# Altium project PAY_IF.PrjPcb (part 5 of 7)

## Sheet SAMA7D65_PIO.SchDoc
size A3; SheetNumber: 8; SheetTotal: 23
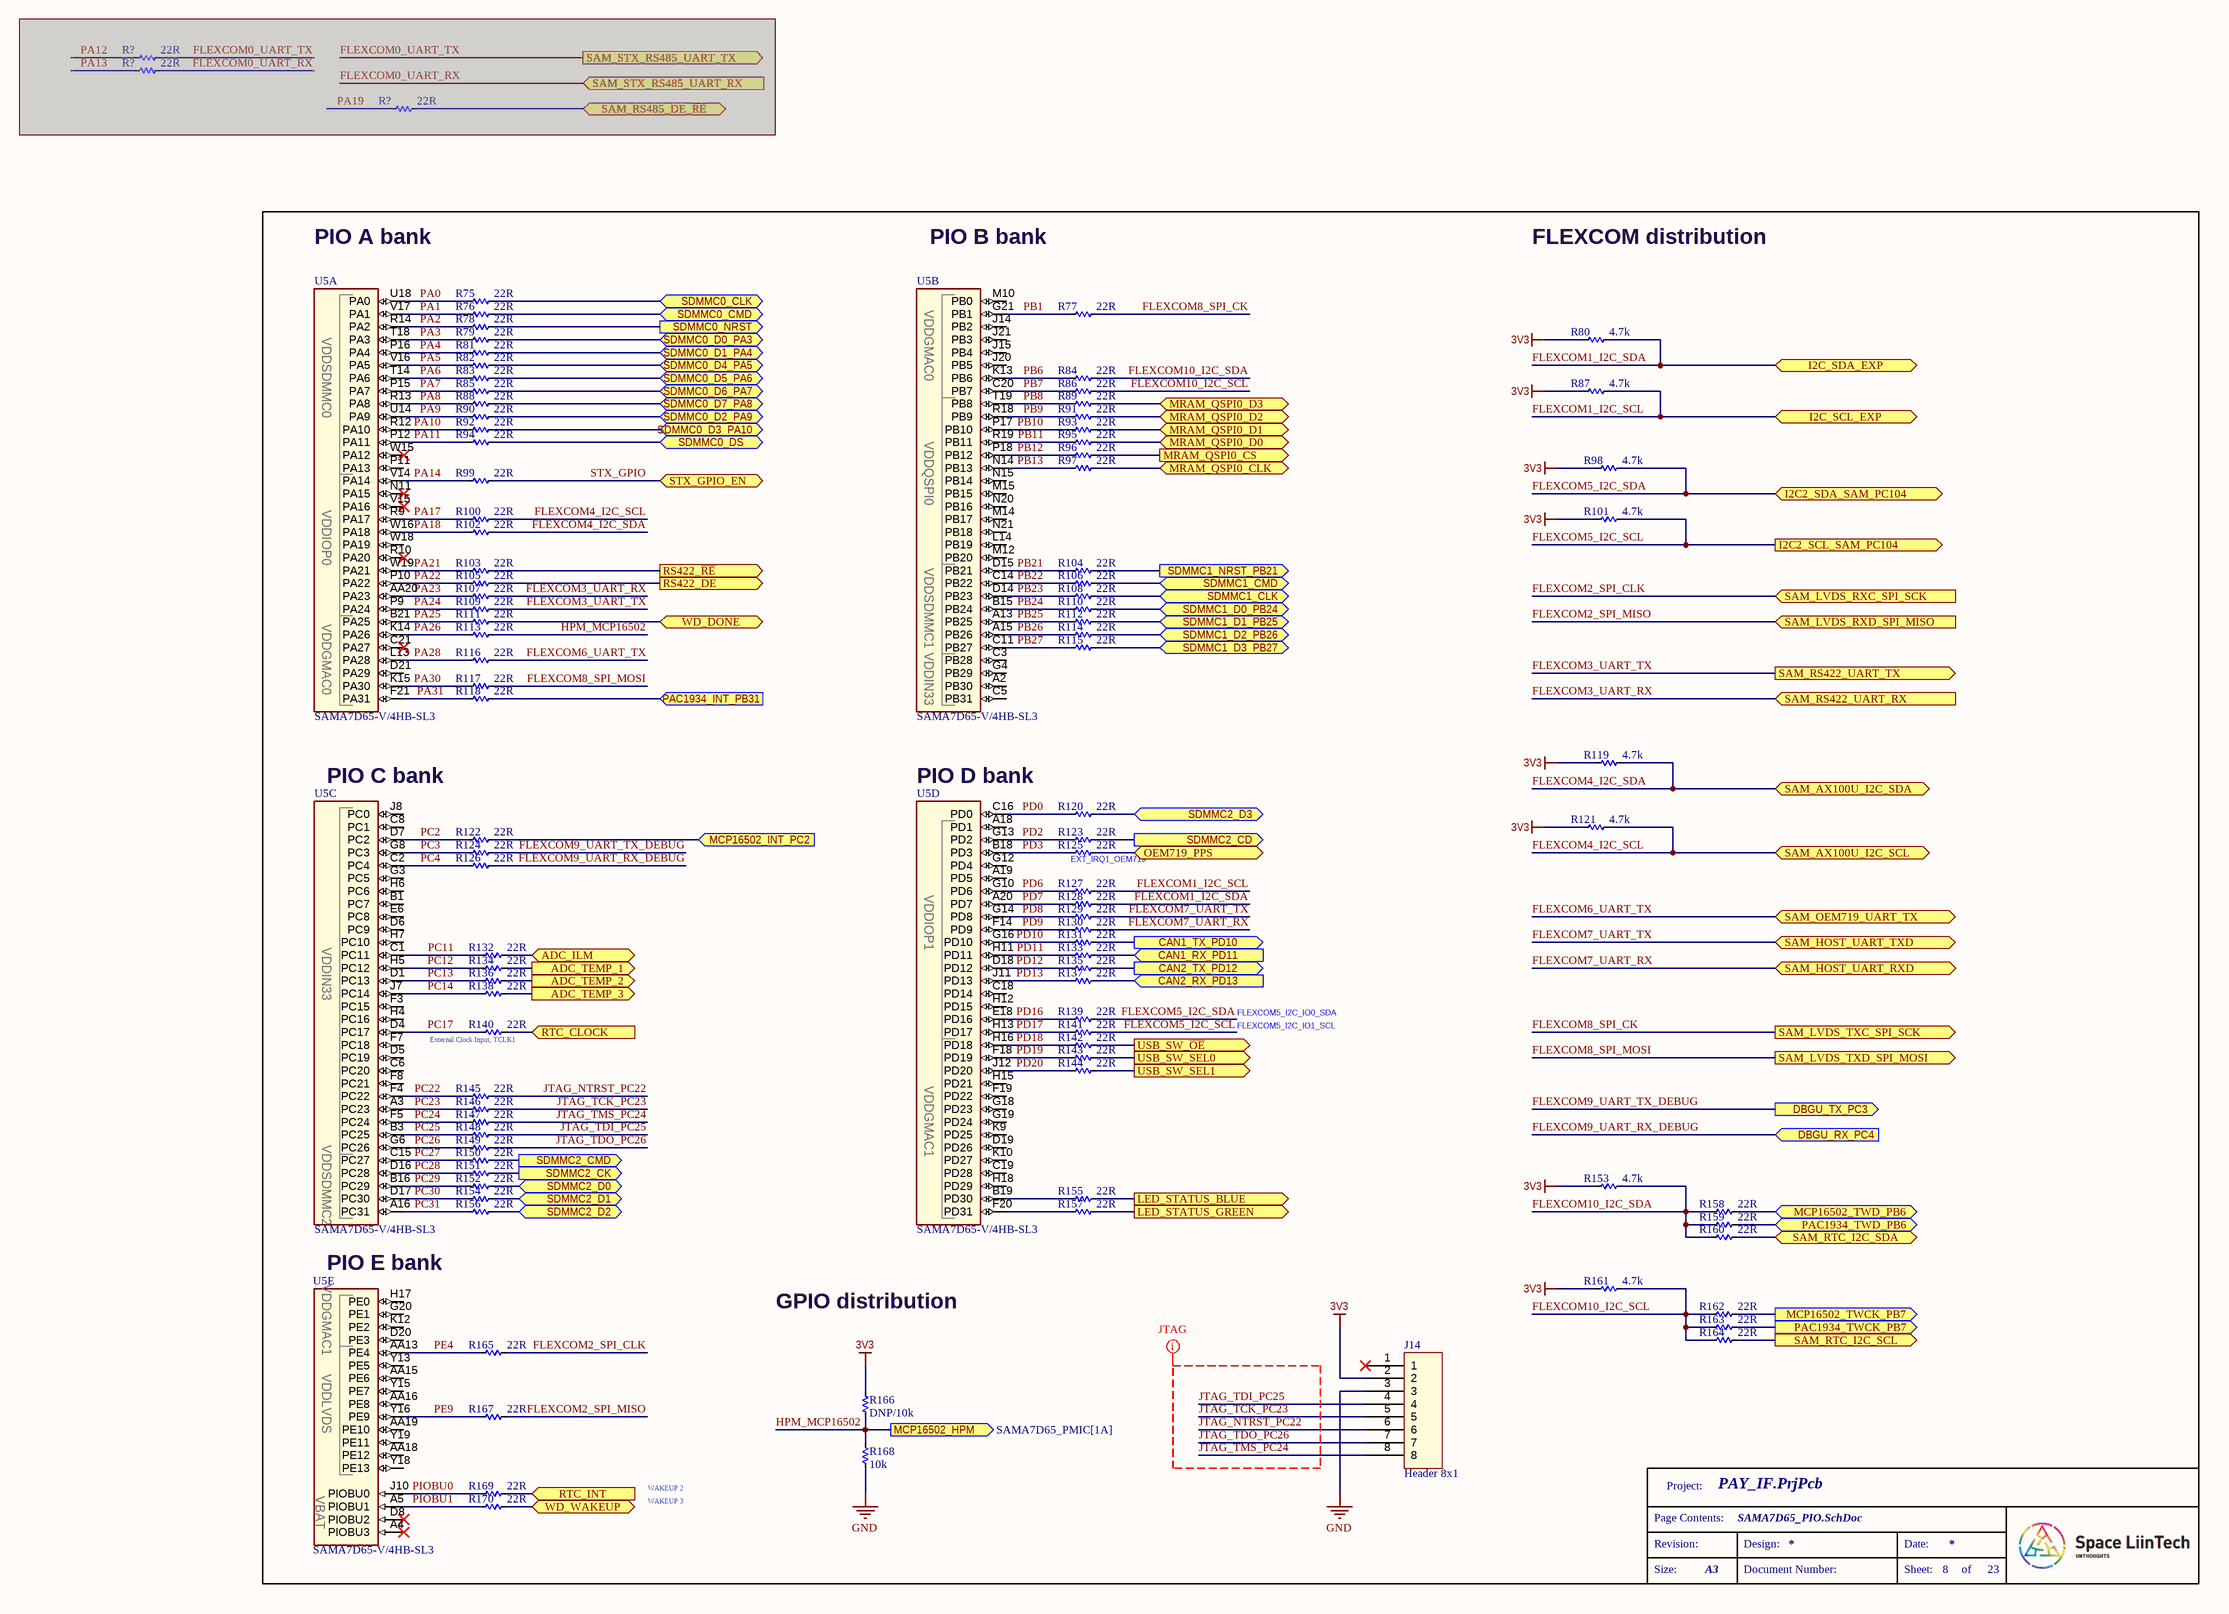
[diagram p8: SAMA7D65_PIO.SchDoc]

### Parts
(Parts that share a designator on the sheet are numbered #1, #2 ... from top to bottom, then left to right.)
J14#1  Header 8x1  [Header_254P_8x1]
R75  22R  [RES_C_0603X30]
R76  22R  [RES_C_0603X30]
R77  22R  [RES_C_0603X30]
R78  22R  [RES_C_0603X30]
R79  22R  [RES_C_0603X30]
R80  4.7k  [RES_C_1005x30_L]
R81  22R  [RES_C_0603X30]
R82  22R  [RES_C_0603X30]
R83  22R  [RES_C_0603X30]
R84  22R  [RES_C_0603X30]
R85  22R  [RES_C_0603X30]
R86  22R  [RES_C_0603X30]
R87  4.7k  [RES_C_1005x30_L]
R88  22R  [RES_C_0603X30]
R89  22R  [RES_C_0603X30]
R90  22R  [RES_C_0603X30]
R91  22R  [RES_C_0603X30]
R92  22R  [RES_C_0603X30]
R93  22R  [RES_C_0603X30]
R94  22R  [RES_C_0603X30]
R95  22R  [RES_C_0603X30]
R96  22R  [RES_C_0603X30]
R97  22R  [RES_C_0603X30]
R98  4.7k  [RES_C_1005x30_L]
R99  22R  [RES_C_0603X30]
R100  22R  [RES_C_0603X30]
R101  4.7k  [RES_C_1005x30_L]
R102  22R  [RES_C_0603X30]
R103  22R  [RES_C_0603X30]
R104  22R  [RES_C_0603X30]
R105  22R  [RES_C_0603X30]
R106  22R  [RES_C_0603X30]
R107  22R  [RES_C_0603X30]
R108  22R  [RES_C_0603X30]
R109  22R  [RES_C_0603X30]
R110  22R  [RES_C_0603X30]
R111  22R  [RES_C_0603X30]
R112  22R  [RES_C_0603X30]
R113  22R  [RES_C_0603X30]
R114  22R  [RES_C_0603X30]
R115  22R  [RES_C_0603X30]
R116  22R  [RES_C_0603X30]
R117  22R  [RES_C_0603X30]
R118  22R  [RES_C_0603X30]
R119  4.7k  [RES_C_1005x30_L]
R120  22R  [RES_C_0603X30]
R121  4.7k  [RES_C_1005x30_L]
R122  22R  [RES_C_0603X30]
R123  22R  [RES_C_0603X30]
R124  22R  [RES_C_0603X30]
R125  22R  [RES_C_0603X30]
R126  22R  [RES_C_0603X30]
R127  22R  [RES_C_0603X30]
R128  22R  [RES_C_0603X30]
R129  22R  [RES_C_0603X30]
R130  22R  [RES_C_0603X30]
R131  22R  [RES_C_0603X30]
R132  22R  [RES_C_0603X30]
R133  22R  [RES_C_0603X30]
R134  22R  [RES_C_0603X30]
R135  22R  [RES_C_0603X30]
R136  22R  [RES_C_0603X30]
R137  22R  [RES_C_0603X30]
R138  22R  [RES_C_0603X30]
R139  22R  [RES_C_0603X30]
R140  22R  [RES_C_0603X30]
R141  22R  [RES_C_0603X30]
R142  22R  [RES_C_0603X30]
R143  22R  [RES_C_0603X30]
R144  22R  [RES_C_0603X30]
R145  22R  [RES_C_0603X30]
R146  22R  [RES_C_0603X30]
R147  22R  [RES_C_0603X30]
R148  22R  [RES_C_0603X30]
R149  22R  [RES_C_0603X30]
R150  22R  [RES_C_0603X30]
R151  22R  [RES_C_0603X30]
R152  22R  [RES_C_0603X30]
R153  4.7k  [RES_C_1005x30_L]
R154  22R  [RES_C_0603X30]
R155  22R  [RES_C_0603X30]
R156  22R  [RES_C_0603X30]
R157  22R  [RES_C_0603X30]
R158  22R  [RES_C_0603X30]
R159  22R  [RES_C_0603X30]
R160  22R  [RES_C_0603X30]
R161  4.7k  [RES_C_1005x30_L]
R162  22R  [RES_C_0603X30]
R163  22R  [RES_C_0603X30]
R164  22R  [RES_C_0603X30]
R165  22R  [RES_C_0603X30]
R166#1  DNP/10k  [RES_C_1005x30_L]
R167#1  22R  [RES_C_0603X30]
R168  10k  [RES_C_1005x30_L]
R169  22R  [RES_C_0603X30]
R170  22R  [RES_C_0603X30]
R?#1  22R  [RES_C_0603X30]  (masked out: inside a compile mask, not in the netlist)
R?#2  22R  [RES_C_0603X30]  (masked out: inside a compile mask, not in the netlist)
R?#3  22R  [RES_C_0603X30]  (masked out: inside a compile mask, not in the netlist)
U5  value SAMA7D65-V/4HB-SL3  [TFBGA-343_14x14]  (hidden comment: SAMA7D65)  (parts A,B,C,D,E of 8)

### Ports
ADC_ILM (bidir, see POWER[6B]), ADC_TEMP_1 (out, see TEMP[5B]), ADC_TEMP_2 (out, see TEMP[5B]), ADC_TEMP_3 (out, see TEMP[5C]), CAN1_RX_PD11 (in, see CAN_PHY[3B]), CAN1_TX_PD10 (out, see CAN_PHY[3B]), CAN2_RX_PD13 (in, see CAN_PHY[3C]), CAN2_TX_PD12 (out, see CAN_PHY[3C]), DBGU_RX_PC4 (in, see DEBUG_CONSOLE[3C]), DBGU_TX_PC3 (out, see DEBUG_CONSOLE[3C]), I2C2_SCL_SAM_PC104 (out, see CONNECTOR_INTERFACE[4B]), I2C2_SDA_SAM_PC104 (bidir, see CONNECTOR_INTERFACE[4B]), I2C_SCL_EXP (bidir, see CONNECTOR_EXP[4C], CONNECTOR_INTERFACE[1D], CONNECTOR_INTERFACE[6B]), I2C_SDA_EXP (bidir, see CONNECTOR_EXP[4C], CONNECTOR_INTERFACE[1C], CONNECTOR_INTERFACE[6B]), LED_STATUS_BLUE (out, see BUTTON_LED[2B]), LED_STATUS_GREEN (out, see BUTTON_LED[2B]), MCP16502_HPM (out, see SAMA7D65_PMIC[1A]), MCP16502_INT_PC2 (in, see SAMA7D65_PMIC[1B]), MCP16502_TWCK_PB7 (out, see SAMA7D65_PMIC[1B]), MCP16502_TWD_PB6 (bidir, see SAMA7D65_PMIC[1B]), MRAM_QSPI0_CLK (bidir, see EEPROM[6C]), MRAM_QSPI0_CS (out, see EEPROM[3B]), MRAM_QSPI0_D0 (bidir, see EEPROM[6C]), MRAM_QSPI0_D1 (bidir, see EEPROM[3B]), MRAM_QSPI0_D2 (bidir, see EEPROM[3C]), MRAM_QSPI0_D3 (bidir, see EEPROM[6B]), OEM719_PPS (bidir, see CONNECTOR_INTERFACE[6B], CONNECTOR_INTERFACE[6D]), PAC1934_INT_PB31 (in, see SAMA7D65_PMIC[7B]), PAC1934_TWCK_PB7 (out, see SAMA7D65_PMIC[7B]), PAC1934_TWD_PB6 (bidir, see SAMA7D65_PMIC[7B]), RS422_DE (out, see RS422[1C]), RS422_~{RE} (out, see RS422[1B]), RTC_CLOCK (in, see RTC[6B]), RTC_INT (in, see RTC[6C]), SAM_AX100U_I2C_SCL (bidir, see CONNECTOR_INTERFACE[5C]), SAM_AX100U_I2C_SDA (bidir, see CONNECTOR_INTERFACE[7C]), SAM_HOST_UART_RXD (bidir, see CONNECTOR_INTERFACE[6D]), SAM_HOST_UART_TXD (bidir, see CONNECTOR_INTERFACE[7D]), SAM_LVDS_RXC_SPI_SCK (in, see LVDS[2C]), SAM_LVDS_RXD_SPI_MISO (in, see LVDS[2C]), SAM_LVDS_TXC_SPI_SCK (out, see LVDS[2B]), SAM_LVDS_TXD_SPI_MOSI (out, see LVDS[2A]), SAM_OEM719_UART_TX (bidir, see CONNECTOR_INTERFACE[4B], CONNECTOR_INTERFACE[7D]), SAM_RS422_UART_RX (in, see RS422[3B]), SAM_RS422_UART_TX (out, see RS422[3C]), SAM_RS485_DE_~{RE} (bidir), SAM_RTC_I2C_SCL (out, see RTC[3C]), SAM_RTC_I2C_SDA (bidir, see RTC[3C]), SAM_STX_RS485_UART_RX (in), SAM_STX_RS485_UART_TX (out), SDMMC0_CLK (bidir, see eMMC[2B]), SDMMC0_CMD (bidir, see eMMC[2B]), SDMMC0_D0_PA3 (bidir, see eMMC[2B]), SDMMC0_D1_PA4 (bidir, see eMMC[2B]), SDMMC0_D2_PA9 (bidir, see eMMC[2B]), SDMMC0_D3_PA10 (bidir, see eMMC[2B]), SDMMC0_D4_PA5 (bidir, see eMMC[2B]), SDMMC0_D5_PA6 (bidir, see eMMC[2B]), SDMMC0_D6_PA7 (bidir, see eMMC[2B]), SDMMC0_D7_PA8 (bidir, see eMMC[2B]), SDMMC0_DS (bidir, see eMMC[3B]), SDMMC0_NRST (out, see eMMC[3B]), SDMMC1_CLK (bidir, see eMMC[2C]), SDMMC1_CMD (bidir, see eMMC[2C]), SDMMC1_D0_PB24 (bidir, see eMMC[2C]), SDMMC1_D1_PB25 (bidir, see eMMC[2C]), SDMMC1_D2_PB26 (bidir, see eMMC[2D]), SDMMC1_D3_PB27 (bidir, see eMMC[2D]), SDMMC1_NRST_PB21 (out, see eMMC[3D]), SDMMC2_CD (out, see SDCARD[3B]), SDMMC2_CK (out, see SDCARD[3B]), SDMMC2_CMD (out, see SDCARD[3C]), SDMMC2_D0 (bidir, see SDCARD[3B]), SDMMC2_D1 (bidir, see SDCARD[3B]), SDMMC2_D2 (bidir, see SDCARD[3B]), SDMMC2_D3 (bidir, see SDCARD[3B]), STX_GPIO_EN (bidir, see CONNECTOR_INTERFACE[6A]), USB_SW_SEL0 (out, see USB_SWITCH[3C]), USB_SW_SEL1 (out, see USB_SWITCH[3C]), USB_SW_~{OE} (out, see USB_SWITCH[3B]), WD_DONE (bidir, see WATCHDOG[5B]), WD_WAKEUP (bidir, see WATCHDOG[5B])

### Nets
3V3: J14#1.2 R80.1 R87.1 R98.1 R101.1 R119.1 R121.1 R153.1 R161.1 R166#1.1
GND: J14#1.3 R168.2
ADC_TEMP_1: R134.2 ; port ADC_TEMP_1
ADC_TEMP_2: R136.2 ; port ADC_TEMP_2
ADC_TEMP_3: R138.2 ; port ADC_TEMP_3
FLEXCOM1_I2C_SCL: R87.2 R127.2 ; port I2C_SCL_EXP
FLEXCOM1_I2C_SDA: R80.2 R128.2 ; port I2C_SDA_EXP
FLEXCOM2_SPI_CLK: R165.2 ; port SAM_LVDS_RXC_SPI_SCK
FLEXCOM2_SPI_MISO: R167#1.2 ; port SAM_LVDS_RXD_SPI_MISO
FLEXCOM3_UART_RX: R107.2 ; port SAM_RS422_UART_RX
FLEXCOM3_UART_TX: R109.2 ; port SAM_RS422_UART_TX
FLEXCOM4_I2C_SCL: R100.2 R121.2 ; port SAM_AX100U_I2C_SCL
FLEXCOM4_I2C_SDA: R102.2 R119.2 ; port SAM_AX100U_I2C_SDA
FLEXCOM5_I2C_SCL: R101.2 R141.2 ; port I2C2_SCL_SAM_PC104
FLEXCOM5_I2C_SDA: R98.2 R139.2 ; port I2C2_SDA_SAM_PC104
FLEXCOM6_UART_TX: R116.2 ; port SAM_OEM719_UART_TX
FLEXCOM7_UART_RX: R130.2 ; port SAM_HOST_UART_RXD
FLEXCOM7_UART_TX: R129.2 ; port SAM_HOST_UART_TXD
FLEXCOM8_SPI_CK: R77.2 ; port SAM_LVDS_TXC_SPI_SCK
FLEXCOM8_SPI_MOSI: R117.2 ; port SAM_LVDS_TXD_SPI_MOSI
FLEXCOM9_UART_RX_DEBUG: R126.2 ; port DBGU_RX_PC4
FLEXCOM9_UART_TX_DEBUG: R124.2 ; port DBGU_TX_PC3
FLEXCOM10_I2C_SCL: R86.2 R161.2 R162.1 R163.1 R164.1
FLEXCOM10_I2C_SDA: R84.2 R153.2 R158.1 R159.1 R160.1
HPM_MCP16502: R113.2 R166#1.2 R168.1 ; port MCP16502_HPM
JTAG_NTRST_PC22: J14#1.6 R145.2
JTAG_TCK_PC23: J14#1.5 R146.2
JTAG_TDI_PC25: J14#1.4 R148.2
JTAG_TDO_PC26: J14#1.7 R149.2
JTAG_TMS_PC24: J14#1.8 R147.2
MRAM_QSPI_CLK: R97.2 ; port MRAM_QSPI0_CLK
MRAM_QSPI_CS: R96.2 ; port MRAM_QSPI0_CS
MRAM_QSPI_D0: R95.2 ; port MRAM_QSPI0_D0
MRAM_QSPI_D1: R93.2 ; port MRAM_QSPI0_D1
MRAM_QSPI_D2: R91.2 ; port MRAM_QSPI0_D2
MRAM_QSPI_D3: R89.2 ; port MRAM_QSPI0_D3
PA0: R75.1 U5.U18(PA0)
PA1: R76.1 U5.V17(PA1)
PA2: R78.1 U5.R14(PA2)
PA3: R79.1 U5.T18(PA3)
PA4: R81.1 U5.P16(PA4)
PA5: R82.1 U5.V16(PA5)
PA6: R83.1 U5.T14(PA6)
PA7: R85.1 U5.P15(PA7)
PA8: R88.1 U5.R13(PA8)
PA9: R90.1 U5.U14(PA9)
PA10: R92.1 U5.R12(PA10)
PA11: R94.1 U5.P12(PA11)
PA14: R99.1 U5.V14(PA14)
PA17: R100.1 U5.R9(PA17)
PA18: R102.1 U5.W16(PA18)
PA21: R103.1 U5.W19(PA21)
PA22: R105.1 U5.P10(PA22)
PA23: R107.1 U5.AA20(PA23)
PA24: R109.1 U5.P9(PA24)
PA25: R111.1 U5.B21(PA25)
PA26: R113.1 U5.K14(PA26)
PA28: R116.1 U5.L13(PA28)
PA30: R117.1 U5.K15(PA30)
PA31: R118.1 U5.F21(PA31)
PAC1934_TWCK: R163.2 ; port PAC1934_TWCK_PB7
PAC1934_TWD: R159.2 ; port PAC1934_TWD_PB6
PB1: R77.1 U5.G21(PB1)
PB6: R84.1 U5.K13(PB6)
PB7: R86.1 U5.C20(PB7)
PB8: R89.1 U5.T19(PB8)
PB9: R91.1 U5.R18(PB9)
PB10: R93.1 U5.P17(PB10)
PB11: R95.1 U5.R19(PB11)
PB12: R96.1 U5.P18(PB12)
PB13: R97.1 U5.N14(PB13)
PB21: R104.1 U5.D15(PB21)
PB22: R106.1 U5.C14(PB22)
PB23: R108.1 U5.D14(PB23)
PB24: R110.1 U5.B15(PB24)
PB25: R112.1 U5.A13(PB25)
PB26: R114.1 U5.A15(PB26)
PB27: R115.1 U5.C11(PB27)
PC2: R122.1 U5.D7(PC2)
PC3: R124.1 U5.G8(PC3)
PC4: R126.1 U5.C2(PC4)
PC11: R132.1 U5.C1(PC11)
PC12: R134.1 U5.H5(PC12)
PC13: R136.1 U5.D1(PC13)
PC14: R138.1 U5.J7(PC14)
PC17: R140.1 U5.D4(PC17)
PC22: R145.1 U5.F4(PC22)
PC23: R146.1 U5.A3(PC23)
PC24: R147.1 U5.F5(PC24)
PC25: R148.1 U5.B3(PC25)
PC26: R149.1 U5.G6(PC26)
PC27: R150.1 U5.C15(PC27)
PC28: R151.1 U5.D16(PC28)
PC29: R152.1 U5.B16(PC29)
PC30: R154.1 U5.D17(PC30)
PC31: R156.1 U5.A16(PC31)
PD0: R120.1 U5.C16(PD0)
PD2: R123.1 U5.G13(PD2)
PD3: R125.1 U5.B18(PD3)
PD6: R127.1 U5.G10(PD6)
PD7: R128.1 U5.A20(PD7)
PD8: R129.1 U5.G14(PD8)
PD9: R130.1 U5.F14(PD9)
PD10: R131.1 U5.G16(PD10)
PD11: R133.1 U5.H11(PD11)
PD12: R135.1 U5.D18(PD12)
PD13: R137.1 U5.J11(PD13)
PD16: R139.1 U5.E18(PD16)
PD17: R141.1 U5.H13(PD17)
PD18: R142.1 U5.H16(PD18)
PD19: R143.1 U5.F18(PD19)
PD20: R144.1 U5.J12(PD20)
PE4: R165.1 U5.AA13(PE4)
PE9: R167#1.1 U5.Y16(PE9)
PIOBU0: R169.1 U5.J10(PIOBU0)
PIOBU1: R170.1 U5.A5(PIOBU1)
RS422_DE: R105.2 ; port RS422_DE
RS422_~{RE}: R103.2 ; port RS422_~{RE}
SAM_RTC_I2C_SCL: R164.2 ; port SAM_RTC_I2C_SCL
SAM_RTC_I2C_SDA: R160.2 ; port SAM_RTC_I2C_SDA
SDMMC0_CLK: R75.2 ; port SDMMC0_CLK
SDMMC0_CMD: R76.2 ; port SDMMC0_CMD
SDMMC0_D0: R79.2 ; port SDMMC0_D0_PA3
SDMMC0_D1: R81.2 ; port SDMMC0_D1_PA4
SDMMC0_D2: R90.2 ; port SDMMC0_D2_PA9
SDMMC0_D3: R92.2 ; port SDMMC0_D3_PA10
SDMMC0_D4: R82.2 ; port SDMMC0_D4_PA5
SDMMC0_D5: R83.2 ; port SDMMC0_D5_PA6
SDMMC0_D6: R85.2 ; port SDMMC0_D6_PA7
SDMMC0_D7: R88.2 ; port SDMMC0_D7_PA8
SDMMC0_DS: R94.2 ; port SDMMC0_DS
SDMMC0_NRST: R78.2 ; port SDMMC0_NRST
SDMMC1_CLK: R108.2 ; port SDMMC1_CLK
SDMMC1_CMD: R106.2 ; port SDMMC1_CMD
SDMMC1_D0: R110.2 ; port SDMMC1_D0_PB24
SDMMC1_D1: R112.2 ; port SDMMC1_D1_PB25
SDMMC1_D2: R114.2 ; port SDMMC1_D2_PB26
SDMMC1_D3: R115.2 ; port SDMMC1_D3_PB27
SDMMC1_NRST: R104.2 ; port SDMMC1_NRST_PB21
STX_GPIO: R99.2 ; port STX_GPIO_EN
NetCR1_3: R151.2 ; port SDMMC2_CK
NetCR1_4: R152.2 ; port SDMMC2_D0
NetCR1_6: R154.2 ; port SDMMC2_D1
NetCR2_1: R150.2 ; port SDMMC2_CMD
NetCR2_4: R156.2 ; port SDMMC2_D2
NetCR2_6: R120.2 ; port SDMMC2_D3
NetD12_2: R155.2 ; port LED_STATUS_BLUE
NetD13_2: R157.2 ; port LED_STATUS_GREEN
NetJ13_19: R125.2 ; port OEM719_PPS
NetJ15_P9: R123.2 ; port SDMMC2_CD
NetR9_1: R132.2 ; port ADC_ILM
NetR52_1: R122.2 ; port MCP16502_INT_PC2
NetR54_1: R118.2 ; port PAC1934_INT_PB31
NetR111_2: R111.2 ; port WD_DONE
NetR131_2: R131.2 ; port CAN1_TX_PD10
NetR133_2: R133.2 ; port CAN1_RX_PD11
NetR135_2: R135.2 ; port CAN2_TX_PD12
NetR137_2: R137.2 ; port CAN2_RX_PD13
NetR140_2: R140.2 ; port RTC_CLOCK
NetR142_2: R142.2 ; port USB_SW_~{OE}
NetR143_2: R143.2 ; port USB_SW_SEL0
NetR144_2: R144.2 ; port USB_SW_SEL1
NetR155_1: R155.1 U5.B19(PD30)
NetR157_1: R157.1 U5.F20(PD31)
NetR158_2: R158.2 ; port MCP16502_TWD_PB6
NetR162_2: R162.2 ; port MCP16502_TWCK_PB7
NetR169_2: R169.2 ; port RTC_INT
NetR170_2: R170.2 ; port WD_WAKEUP

Not connected (* = marked no-connect by the designer): J14#1 1*; U5 A2(PB30) A4(PIOBU3)* A18(PD1) A19(PD5) AA15(PE6) AA16(PE8) AA18(PE12) AA19(PE10) B1(PC7) C3(PB28) C5(PB31) C6(PC20) C8(PC1) C18(PD14) C19(PD28) C21(PA27)* D5(PC19) D6(PC9) D8(PIOBU2)* D19(PD26) D20(PE3) D21(PA29) E6(PC8) F3(PC15) F7(PC18) F8(PC21) F19(PD22) G3(PC5) G4(PB29) G12(PD4) G18(PD23) G19(PD24) G20(PE1) H4(PC16) H6(PC6) H7(PC10) H12(PD15) H15(PD21) H17(PE0) H18(PD29) J8(PC0) J14(PB2) J15(PB4) J20(PB5) J21(PB3) K9(PD25) K10(PD27) K12(PE2) L14(PB19) M10(PB0) M12(PB20) M14(PB17) M15(PB15) N11(PA15)* N15(PB14) N20(PB16) N21(PB18) P11(PA13) R10(PA20)* V15(PA16)* W15(PA12)* W18(PA19) Y13(PE5) Y15(PE7) Y18(PE13) Y19(PE11)

### Layout directives
net class JTAG; rule Matched Net Lengths [Tolerance = 2mm]: JTAG_NTRST_PC22, JTAG_TCK_PC23, JTAG_TDI_PC25, JTAG_TDO_PC26, JTAG_TMS_PC24

### Notes on the sheet
- PIO A bank
- PIO B bank
- FLEXCOM distribution
- (near U5) PIO C bank
- (near U5) PIO D bank
- (near R125) EXT_IRQ1_OEM719
- (near R140) External Clock Input, TCLK1
- FLEXCOM5_I2C_IO0_SDA
- FLEXCOM5_I2C_IO1_SCL
- (near U5) PIO E bank
- GPIO distribution
- WAKEUP 2
- WAKEUP 3
- Project:
- Page Contents:
- Revision:
- Design:
- Date:
- Size:
- A3
- Document Number:
- Sheet:
- of

### Library data of the parts
R75-R165 R166#1 R167#1 R168-R170 R?#1-R?#3 = _RES_B_2: RES
U5 = SAMA7D65: SAMA7D65 MPU 1000MHz Cortex-A7 TFBGA-343; Manufacturer 1: Microchip Technology; Description_: MCHP MPU 32-BIT Cortex-A7 1000MHz 128kB SAMA7D65-V/4HB-SL3 TFBGA-343; Populated: YES; MCHP-ID: IC2674; Symbol: SAMA7D65-TFBGA-343; Dev Tools Status: Design; Owner: Ciprian Abramov; Restricted Sourcing: No; Manufacturer Part Number 1: SAMA7D65-V/4HB-SL3; Type: 32-Bit MPU; Status: MCL Design; Revision: 1; Category: MCHP-Microcontroller; ComponentLink1URL: https://www.microchip.com/sitesearch/search/Product%20and%20Development%20Tools/SAMA7D65-V/4HB-SL3; ComponentLink1Description: SVN Datasheet; ComponentLink2Description: Local Datasheet; ComponentLink3URL: C:\ALTIUM_WORK\00001_MCHP-CDB\Library\LibraryRefs\SAMA7D65-TFBGA-343.SchLib; ComponentLink3Description: Open Symbol; ComponentLink4URL: C:\ALTIUM_WORK\00001_MCHP-CDB\Library\Footprints\TFBGA-343_14x14.PcbLib; ComponentLink4Description: Open Footprint; ComponentLink5Description: Open Footprint 2; ComponentLink6Description: Open Footprint 3; ComponentLink7Description: Open Footprint 4; Supplier 1: Microchip Technology; Supplier Part Number 1: SAMA7D65-V/4HB-SL3; Operating Temperature: -40C to +105C; Quantity Override: 1

## Sheet SAMA7D65_DDR3L.SchDoc
size A3; SheetNumber: 9; SheetTotal: 23
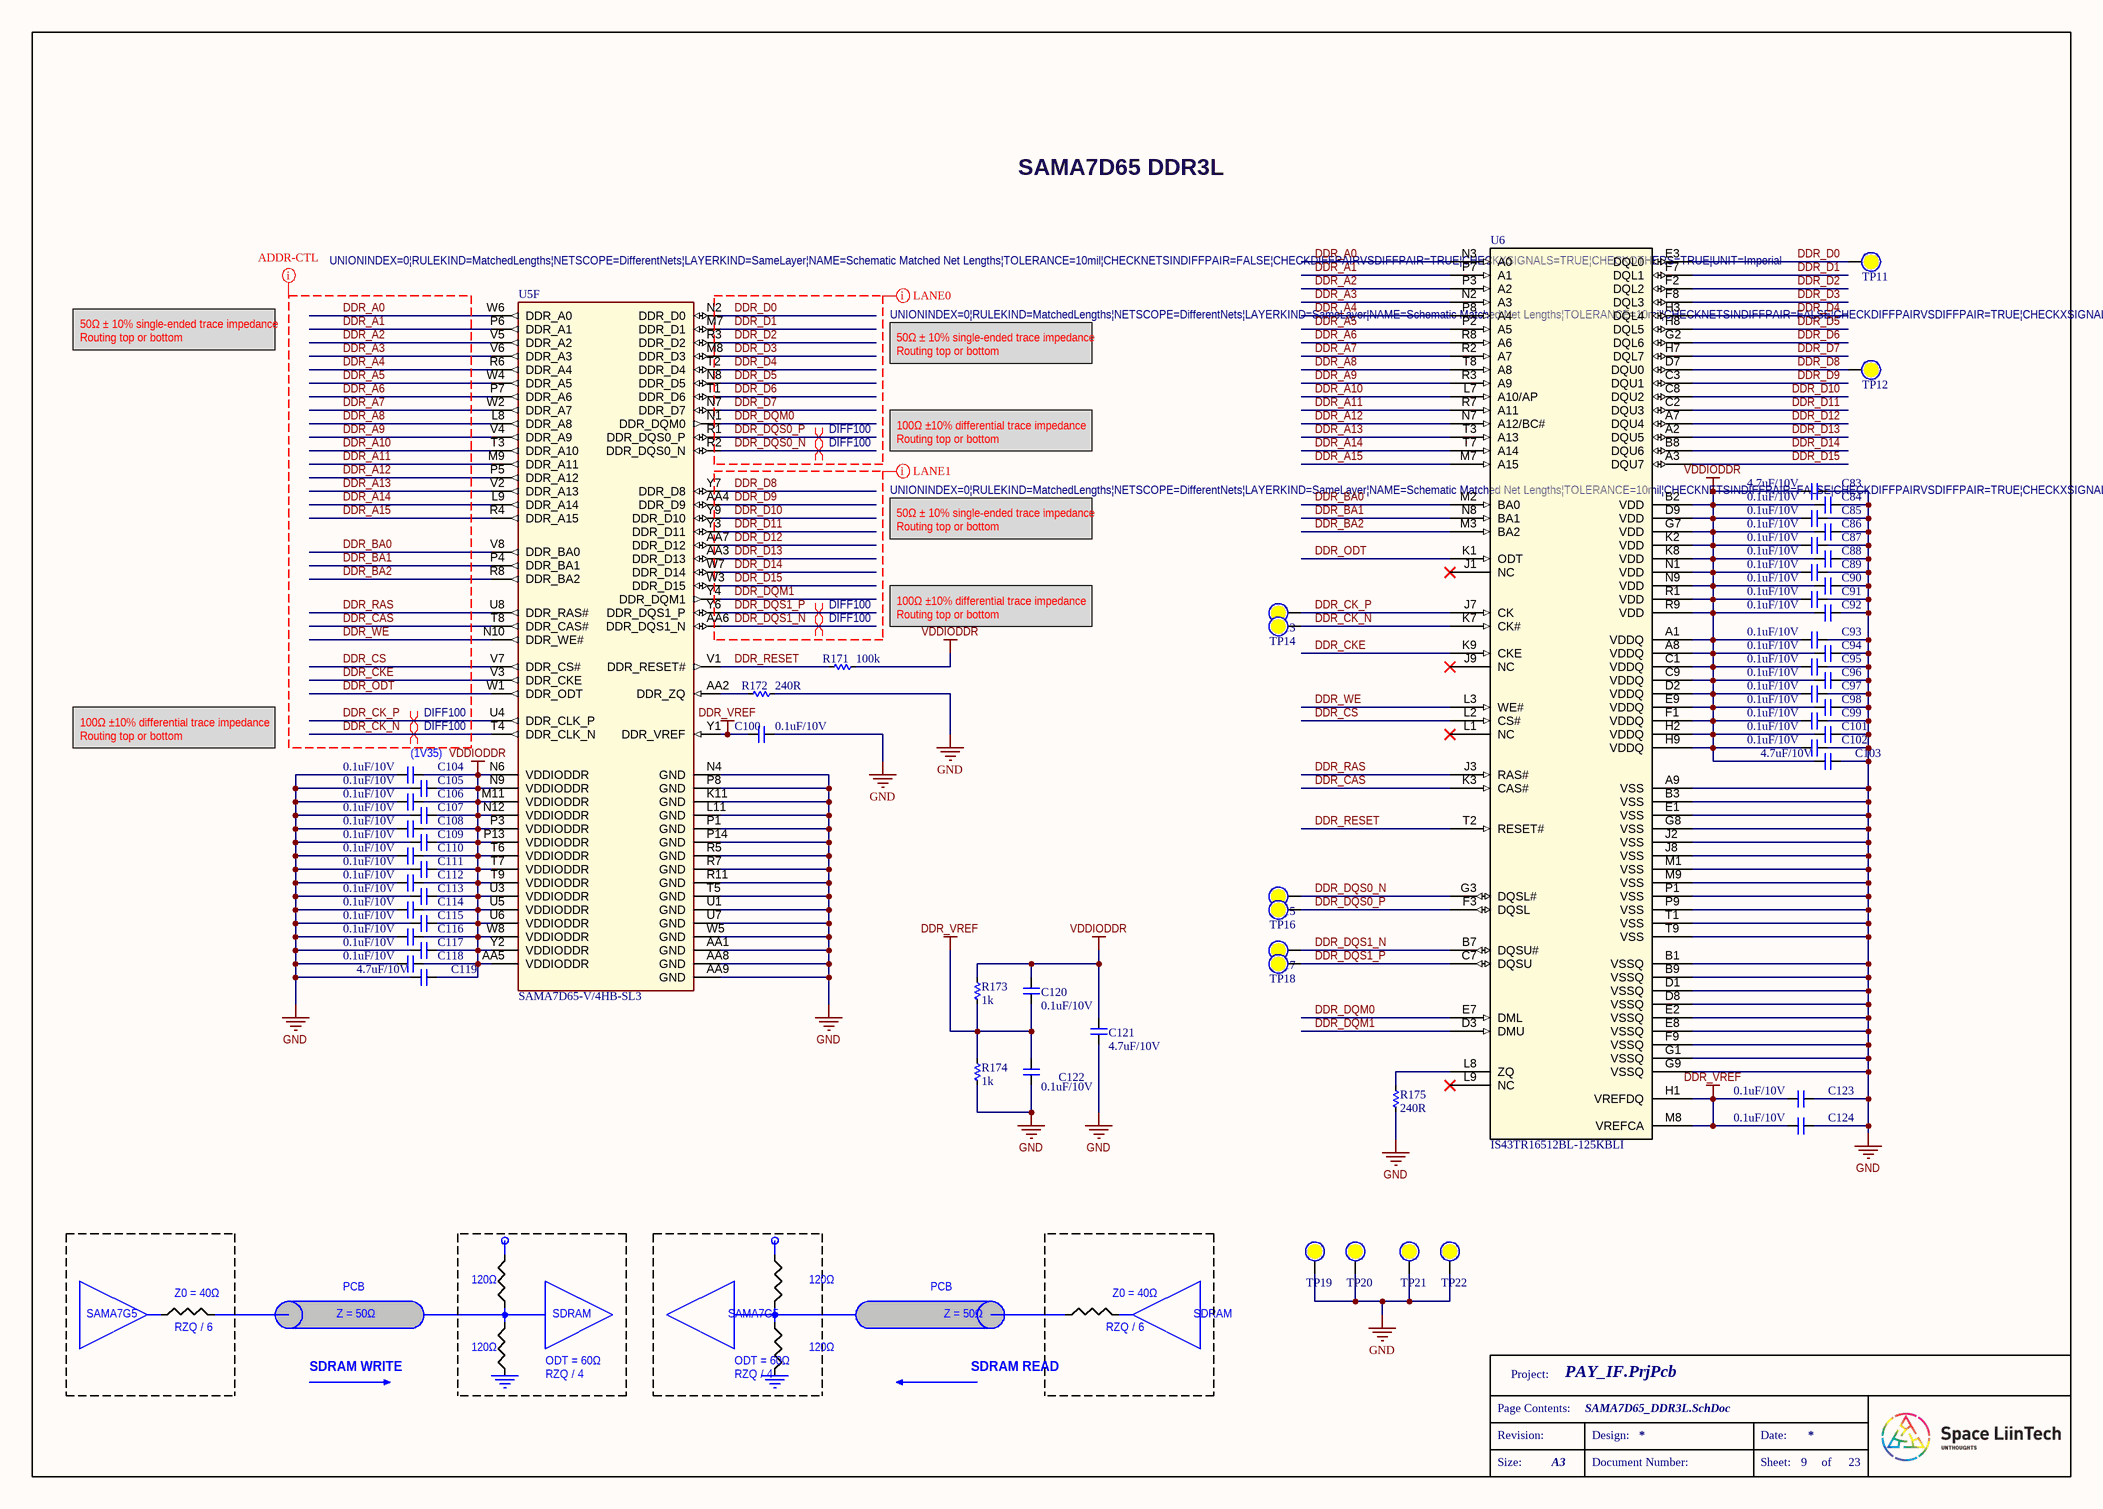
[diagram p9: SAMA7D65_DDR3L.SchDoc]

### Parts
C83  4.7uF/10V  [CAP_C_1005X50_L]
C84  0.1uF/10V  [CAP_C_0603x30]
C85  0.1uF/10V  [CAP_C_0603x30]
C86  0.1uF/10V  [CAP_C_0603x30]
C87  0.1uF/10V  [CAP_C_0603x30]
C88  0.1uF/10V  [CAP_C_0603x30]
C89  0.1uF/10V  [CAP_C_0603x30]
C90  0.1uF/10V  [CAP_C_0603x30]
C91  0.1uF/10V  [CAP_C_0603x30]
C92  0.1uF/10V  [CAP_C_0603x30]
C93  0.1uF/10V  [CAP_C_0603x30]
C94  0.1uF/10V  [CAP_C_0603x30]
C95  0.1uF/10V  [CAP_C_0603x30]
C96  0.1uF/10V  [CAP_C_0603x30]
C97  0.1uF/10V  [CAP_C_0603x30]
C98  0.1uF/10V  [CAP_C_0603x30]
C99  0.1uF/10V  [CAP_C_0603x30]
C100  0.1uF/10V  [CAP_C_0603x30]
C101  0.1uF/10V  [CAP_C_0603x30]
C102  0.1uF/10V  [CAP_C_0603x30]
C103  4.7uF/10V  [CAP_C_1005X50_L]
C104  0.1uF/10V  [CAP_C_0603x30]
C105  0.1uF/10V  [CAP_C_0603x30]
C106  0.1uF/10V  [CAP_C_0603x30]
C107  0.1uF/10V  [CAP_C_0603x30]
C108  0.1uF/10V  [CAP_C_0603x30]
C109  0.1uF/10V  [CAP_C_0603x30]
C110  0.1uF/10V  [CAP_C_0603x30]
C111  0.1uF/10V  [CAP_C_0603x30]
C112  0.1uF/10V  [CAP_C_0603x30]
C113  0.1uF/10V  [CAP_C_0603x30]
C114  0.1uF/10V  [CAP_C_0603x30]
C115  0.1uF/10V  [CAP_C_0603x30]
C116  0.1uF/10V  [CAP_C_0603x30]
C117  0.1uF/10V  [CAP_C_0603x30]
C118  0.1uF/10V  [CAP_C_0603x30]
C119  4.7uF/10V  [CAP_C_1005X50_L]
C120  0.1uF/10V  [CAP_C_0603x30]
C121  4.7uF/10V  [CAP_C_1005X50_L]
C122  0.1uF/10V  [CAP_C_0603x30]
C123  0.1uF/10V  [CAP_C_0603x30]
C124  0.1uF/10V  [CAP_C_0603x30]
R171  100k  [RES_C_1005x30_L]
R172  240R  [RES_C_0603X30]
R173  1k  [RES_C_1005x30_L]
R174  1k  [RES_C_1005x30_L]
R175  240R  [RES_C_0603X30]
TP11  (no value)  [Test point]  (no BOM)
TP12  (no value)  [Test point]  (no BOM)
TP13  (no value)  [Test point]  (no BOM)
TP14  (no value)  [Test point]  (no BOM)
TP15  (no value)  [Test point]  (no BOM)
TP16  (no value)  [Test point]  (no BOM)
TP17  (no value)  [Test point]  (no BOM)
TP18  (no value)  [Test point]  (no BOM)
TP19  (no value)  [Test point]  (no BOM)
TP20  (no value)  [Test point]  (no BOM)
TP21  (no value)  [Test point]  (no BOM)
TP22  (no value)  [Test point]  (no BOM)
U5  value SAMA7D65-V/4HB-SL3  [TFBGA-343_14x14]  (hidden comment: SAMA7D65)  (part F of 8)
U6  IS43TR16512BL-125KBLI  [TWBGA96_ISI]

### Nets
DDR_VREF: C100.1 C120.1 C122.2 C123.1 C124.1 R173.1 R174.2 U5.Y1(DDR_VREF) U6.H1(VREFDQ) U6.M8(VREFCA)
GND: C83.2 C84.2 C85.2 C86.2 C87.2 C88.2 C89.2 C90.2 C91.2 C92.2 C93.2 C94.2 C95.2 C96.2 C97.2 C98.2 C99.2 C100.2 C101.2 C102.2 C103.2 C104.1 C105.1 C106.1 C107.1 C108.1 C109.1 C110.1 C111.1 C112.1 C113.1 C114.1 C115.1 C116.1 C117.1 C118.1 C119.1 C121.1 C122.1 C123.2 C124.2 R172.2 R174.1 R175.1 TP19.0 TP20.0 TP21.0 TP22.0 U5.AA1(GND) U5.AA8(GND) U5.AA9(GND) U5.K11(GND) U5.L11(GND) U5.N4(GND) U5.P1(GND) U5.P8(GND) U5.P14(GND) U5.R5(GND) U5.R7(GND) U5.R11(GND) U5.T5(GND) U5.U1(GND) U5.U7(GND) U5.W5(GND) U6.A9(VSS) U6.B1(VSSQ) U6.B3(VSS) U6.B9(VSSQ) U6.D1(VSSQ) U6.D8(VSSQ) U6.E1(VSS) U6.E2(VSSQ) U6.E8(VSSQ) U6.F9(VSSQ) U6.G1(VSSQ) U6.G8(VSS) U6.G9(VSSQ) U6.J2(VSS) U6.J8(VSS) U6.M1(VSS) U6.M9(VSS) U6.P1(VSS) U6.P9(VSS) U6.T1(VSS) U6.T9(VSS)
VDDIODDR: C83.1 C84.1 C85.1 C86.1 C87.1 C88.1 C89.1 C90.1 C91.1 C92.1 C93.1 C94.1 C95.1 C96.1 C97.1 C98.1 C99.1 C101.1 C102.1 C103.1 C104.2 C105.2 C106.2 C107.2 C108.2 C109.2 C110.2 C111.2 C112.2 C113.2 C114.2 C115.2 C116.2 C117.2 C118.2 C119.2 C120.2 C121.2 R171.2 R173.2 U5.AA5(VDDIODDR) U5.M11(VDDIODDR) U5.N6(VDDIODDR) U5.N9(VDDIODDR) U5.N12(VDDIODDR) U5.P3(VDDIODDR) U5.P13(VDDIODDR) U5.T6(VDDIODDR) U5.T7(VDDIODDR) U5.T9(VDDIODDR) U5.U3(VDDIODDR) U5.U5(VDDIODDR) U5.U6(VDDIODDR) U5.W8(VDDIODDR) U5.Y2(VDDIODDR) U6.A1(VDDQ) U6.A8(VDDQ) U6.B2(VDD) U6.C1(VDDQ) U6.C9(VDDQ) U6.D2(VDDQ) U6.D9(VDD) U6.E9(VDDQ) U6.F1(VDDQ) U6.G7(VDD) U6.H2(VDDQ) U6.H9(VDDQ) U6.K2(VDD) U6.K8(VDD) U6.N1(VDD) U6.N9(VDD) U6.R1(VDD) U6.R9(VDD)
DDR_A0: U5.W6(DDR_A0) U6.N3(A0)
DDR_A1: U5.P6(DDR_A1) U6.P7(A1)
DDR_A2: U5.V5(DDR_A2) U6.P3(A2)
DDR_A3: U5.V6(DDR_A3) U6.N2(A3)
DDR_A4: U5.R6(DDR_A4) U6.P8(A4)
DDR_A5: U5.W4(DDR_A5) U6.P2(A5)
DDR_A6: U5.P7(DDR_A6) U6.R8(A6)
DDR_A7: U5.W2(DDR_A7) U6.R2(A7)
DDR_A8: U5.L8(DDR_A8) U6.T8(A8)
DDR_A9: U5.V4(DDR_A9) U6.R3(A9)
DDR_A10: U5.T3(DDR_A10) U6.L7(A10/AP)
DDR_A11: U5.M9(DDR_A11) U6.R7(A11)
DDR_A12: U5.P5(DDR_A12) U6.N7(A12/BC#)
DDR_A13: U5.V2(DDR_A13) U6.T3(A13)
DDR_A14: U5.L9(DDR_A14) U6.T7(A14)
DDR_A15: U5.R4(DDR_A15) U6.M7(A15)
DDR_BA0: U5.V8(DDR_BA0) U6.M2(BA0)
DDR_BA1: U5.P4(DDR_BA1) U6.N8(BA1)
DDR_BA2: U5.R8(DDR_BA2) U6.M3(BA2)
DDR_CAS: U5.T8(DDR_CAS#) U6.K3(CAS#)
DDR_CK_N: TP14.0 U5.T4(DDR_CLK_N) U6.K7(CK#)
DDR_CK_P: TP13.0 U5.U4(DDR_CLK_P) U6.J7(CK)
DDR_CKE: U5.V3(DDR_CKE) U6.K9(CKE)
DDR_CS: U5.V7(DDR_CS#) U6.L2(CS#)
DDR_D0: TP11.0 U5.N2(DDR_D0) U6.E3(DQL0)
DDR_D1: U5.M7(DDR_D1) U6.F7(DQL1)
DDR_D2: U5.R3(DDR_D2) U6.F2(DQL2)
DDR_D3: U5.M8(DDR_D3) U6.F8(DQL3)
DDR_D4: U5.T2(DDR_D4) U6.H3(DQL4)
DDR_D5: U5.N8(DDR_D5) U6.H8(DQL5)
DDR_D6: U5.T1(DDR_D6) U6.G2(DQL6)
DDR_D7: U5.N7(DDR_D7) U6.H7(DQL7)
DDR_D8: TP12.0 U5.Y7(DDR_D8) U6.D7(DQU0)
DDR_D9: U5.AA4(DDR_D9) U6.C3(DQU1)
DDR_D10: U5.Y9(DDR_D10) U6.C8(DQU2)
DDR_D11: U5.Y3(DDR_D11) U6.C2(DQU3)
DDR_D12: U5.AA7(DDR_D12) U6.A7(DQU4)
DDR_D13: U5.AA3(DDR_D13) U6.A2(DQU5)
DDR_D14: U5.W7(DDR_D14) U6.B8(DQU6)
DDR_D15: U5.W3(DDR_D15) U6.A3(DQU7)
DDR_DQM0: U5.N1(DDR_DQM0) U6.E7(DML)
DDR_DQM1: U5.Y4(DDR_DQM1) U6.D3(DMU)
DDR_DQS0_N: TP15.0 U5.R2(DDR_DQS0_N) U6.G3(DQSL#)
DDR_DQS0_P: TP16.0 U5.R1(DDR_DQS0_P) U6.F3(DQSL)
DDR_DQS1_N: TP17.0 U5.AA6(DDR_DQS1_N) U6.B7(DQSU#)
DDR_DQS1_P: TP18.0 U5.Y6(DDR_DQS1_P) U6.C7(DQSU)
DDR_ODT: U5.W1(DDR_ODT) U6.K1(ODT)
DDR_RAS: U5.U8(DDR_RAS#) U6.J3(RAS#)
DDR_RESET: R171.1 U5.V1(DDR_RESET#) U6.T2(RESET#)
DDR_WE: U5.N10(DDR_WE#) U6.L3(WE#)
NetR172_1: R172.1 U5.AA2(DDR_ZQ)
NetR175_2: R175.2 U6.L8(ZQ)

Not connected (* = marked no-connect by the designer): U6 J1(NC)* J9(NC)* L1(NC)* L9(NC)*

### Layout directives
net class DDR-ADDR-CTL; rule Matched Net Lengths [Tolerance = 10mil]: DDR_A0, DDR_A1, DDR_A2, DDR_A3, DDR_A4, DDR_A5, DDR_A6, DDR_A7, DDR_A8, DDR_A9, DDR_A10, DDR_A11, DDR_A12, DDR_A13, DDR_A14, DDR_A15, DDR_BA0, DDR_BA1, DDR_BA2, DDR_CAS, DDR_CK_N, DDR_CK_P, DDR_CKE, DDR_CS, DDR_ODT, DDR_RAS, DDR_WE
differential pair; differential pair class DIFF100; net class DIFF100; rule Matched Net Lengths [Tolerance = 4mil]: DDR_CK_N, DDR_CK_P, DDR_DQS0_N, DDR_DQS0_P, DDR_DQS1_N, DDR_DQS1_P
net class DDR-LANE0; rule Matched Net Lengths [Tolerance = 10mil]: DDR_D0, DDR_D1, DDR_D2, DDR_D3, DDR_D4, DDR_D5, DDR_D6, DDR_D7, DDR_DQM0, DDR_DQS0_N, DDR_DQS0_P
net class DDR-LANE1; rule Matched Net Lengths [Tolerance = 10mil]: DDR_D8, DDR_D9, DDR_D10, DDR_D11, DDR_D12, DDR_D13, DDR_D14, DDR_D15, DDR_DQM1, DDR_DQS1_N, DDR_DQS1_P

### Notes on the sheet
- SAMA7D65 DDR3L
- 50Ω ± 10% single-ended trace impedance
  Routing top or bottom
- 100Ω ±10% differential trace impedance
  Routing top or bottom
- (near C104) (1V35)
- SAMA7G5
- Z0 = 40Ω
- Z = 50Ω
- PCB
- 120Ω
- SDRAM
- RZQ / 6
- SDRAM WRITE
- ODT = 60Ω
- RZQ / 4
- SDRAM READ
- Project:
- Page Contents:
- Revision:
- Design:
- Date:
- Size:
- A3
- Document Number:
- Sheet:
- of

### Library data of the parts
C83-C124 = _CAP_C_2: CAP CHIP
R171-R175 = _RES_B_2: RES
TP11-TP22 = Test Point: Solder: NF
U5 = SAMA7D65: as U5 on sheet SAMA7D65_PIO; Manufacturer Part Number 1: SAMA7D65-V/4HB-SL3; Type: 32-Bit MPU; Status: MCL Design; Revision: 1; Category: MCHP-Microcontroller; ComponentLink1URL: https://www.microchip.com/sitesearch/search/Product%20and%20Development%20Tools/SAMA7D65-V/4HB-SL3; ComponentLink1Description: SVN Datasheet; ComponentLink2Description: Local Datasheet; ComponentLink3URL: C:\ALTIUM_WORK\00001_MCHP-CDB\Library\LibraryRefs\SAMA7D65-TFBGA-343.SchLib; ComponentLink3Description: Open Symbol; ComponentLink4URL: C:\ALTIUM_WORK\00001_MCHP-CDB\Library\Footprints\TFBGA-343_14x14.PcbLib; ComponentLink4Description: Open Footprint; ComponentLink5Description: Open Footprint 2; ComponentLink6Description: Open Footprint 3; ComponentLink7Description: Open Footprint 4; Supplier 1: Microchip Technology; Supplier Part Number 1: SAMA7D65-V/4HB-SL3; Operating Temperature: -40C to +105C; Quantity Override: 1
U6 = IC_RAM_IS43TR16512BL-125KBLI: DDR3L; Manufacturer_Name: ISSI; Copyright: Copyright (C) 2025 Ultra Librarian. All rights reserved.; Manufacturer_Part_Number: IS43TR16512BL-125KBLI; RefDes: RefDes; Type: Type

## Sheet SDCARD.SchDoc
size A3; SheetNumber: 10; SheetTotal: 23
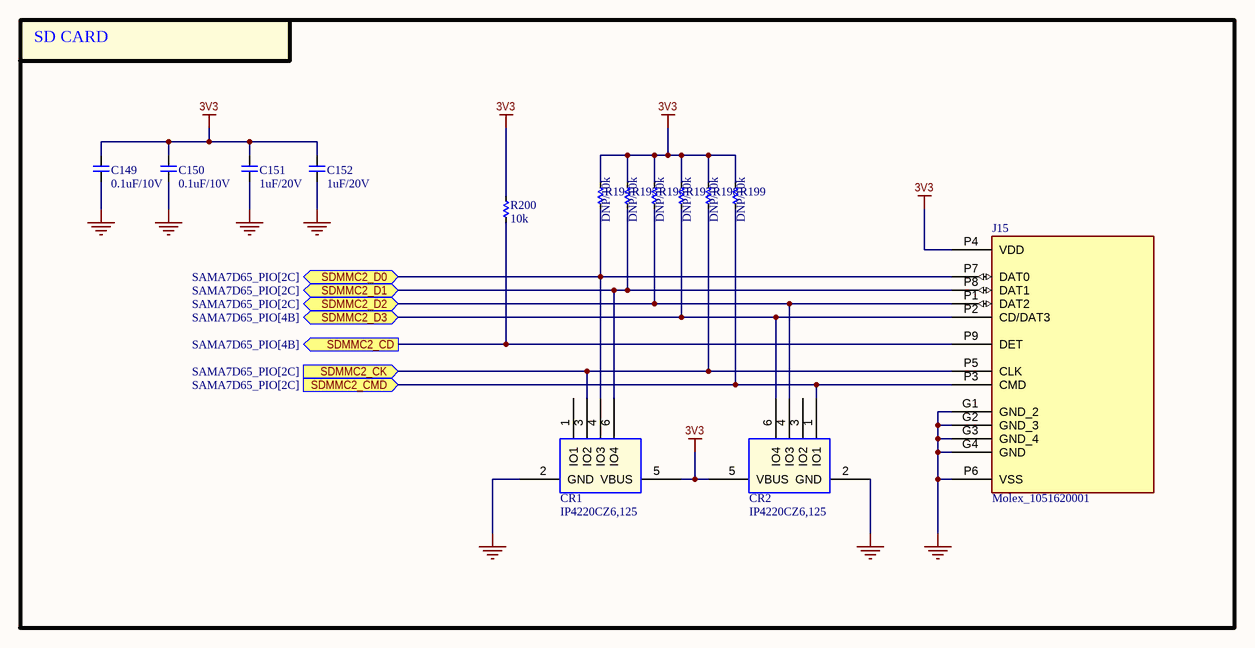
[diagram p10: SDCARD.SchDoc]

### Parts
(Parts that share a designator on the sheet are numbered #1, #2 ... from top to bottom, then left to right.)
C149  0.1uF/10V  [CAP_C_1005X50_L]
C150#1  0.1uF/10V  [CAP_C_1005X50_L]
C151  1uF/20V  [CAP_C_1005X50_L]
C152  1uF/20V  [CAP_C_1005X50_L]
CR1  IP4220CZ6,125  [DIODE_SOT457_1P7X3P1_NEX]
CR2  IP4220CZ6,125  [DIODE_SOT457_1P7X3P1_NEX]
J15  Molex_1051620001  [MOLEX_1051620001]
R194  DNP/10k  [RES_C_1005x30_L]
R195  DNP/10k  [RES_C_1005x30_L]
R196  DNP/10k  [RES_C_1005x30_L]
R197  DNP/10k  [RES_C_1005x30_L]
R198  DNP/10k  [RES_C_1005x30_L]
R199  DNP/10k  [RES_C_1005x30_L]
R200  10k  [RES_C_1005x30_L]

### Blocks framed on the sheet
SD CARD: C149 C150#1 C151 C152 CR1 CR2 J15 R194-R200

### Ports
SDMMC2_CD (out, see SAMA7D65_PIO[4B]), SDMMC2_CK (in, see SAMA7D65_PIO[2C]), SDMMC2_CMD (in, see SAMA7D65_PIO[2C]), SDMMC2_D0 (bidir, see SAMA7D65_PIO[2C]), SDMMC2_D1 (bidir, see SAMA7D65_PIO[2C]), SDMMC2_D2 (bidir, see SAMA7D65_PIO[2C]), SDMMC2_D3 (bidir, see SAMA7D65_PIO[4B])

### Nets
3V3: C149.2 C150#1.2 C151.2 C152.2 CR1.5(VBUS) CR2.5(VBUS) J15.P4(VDD) R194.2 R195.2 R196.2 R197.2 R198.2 R199.2 R200.2
GND: C149.1 C150#1.1 C151.1 C152.1 CR1.2(GND) CR2.2(GND) J15.G1(GND_2) J15.G2(GND_3) J15.G3(GND_4) J15.G4(GND) J15.P6(VSS)
NetCR1_3: CR1.3(IO2) J15.P5(CLK) R198.1 ; port SDMMC2_CK
NetCR1_4: CR1.4(IO3) J15.P7(DAT0) R194.1 ; port SDMMC2_D0
NetCR1_6: CR1.6(IO4) J15.P8(DAT1) R195.1 ; port SDMMC2_D1
NetCR2_1: CR2.1(IO1) J15.P3(CMD) R199.1 ; port SDMMC2_CMD
NetCR2_4: CR2.4(IO3) J15.P1(DAT2) R196.1 ; port SDMMC2_D2
NetCR2_6: CR2.6(IO4) J15.P2(CD/DAT3) R197.1 ; port SDMMC2_D3
NetJ15_P9: J15.P9(DET) R200.1 ; port SDMMC2_CD

Not connected (* = marked no-connect by the designer): CR1 1(IO1); CR2 3(IO2)

### Notes on the sheet
- Project:
- Page Contents:
- Revision:
- Design:
- Date:
- Size:
- A3
- Document Number:
- Sheet:
- of

### Library data of the parts
C149 C150#1 C151 C152 = _CAP_C_2: CAP CHIP
CR1 CR2 = IP4220CZ6,125: TVS DIODE 5.5VWM 6TSOP; Manufacturer_Name: Nexperia; Copyright: Copyright (C) 2025 Ultra Librarian. All rights reserved.; Manufacturer_Part_Number: IP4220CZ6,125; RefDes: RefDes; Type: Type
J15 = Molex_1051620001: 9 (8 + 1) Position Card Connector Secure Digital - microSDâ„¢ Surface Mount, Right Angle Gold; MF: Molex; SnapEDA_Link: https://www.snapeda.com/parts/1051620001/Molex/view-part/?ref=snap; Package: None; Value: *; MP: 1051620001; Check_prices: https://www.snapeda.com/parts/1051620001/Molex/view-part/?ref=eda
R194-R200 = _RES_B_2: RES

## Sheet eMMC.SchDoc
size A3; SheetNumber: 11; SheetTotal: 23
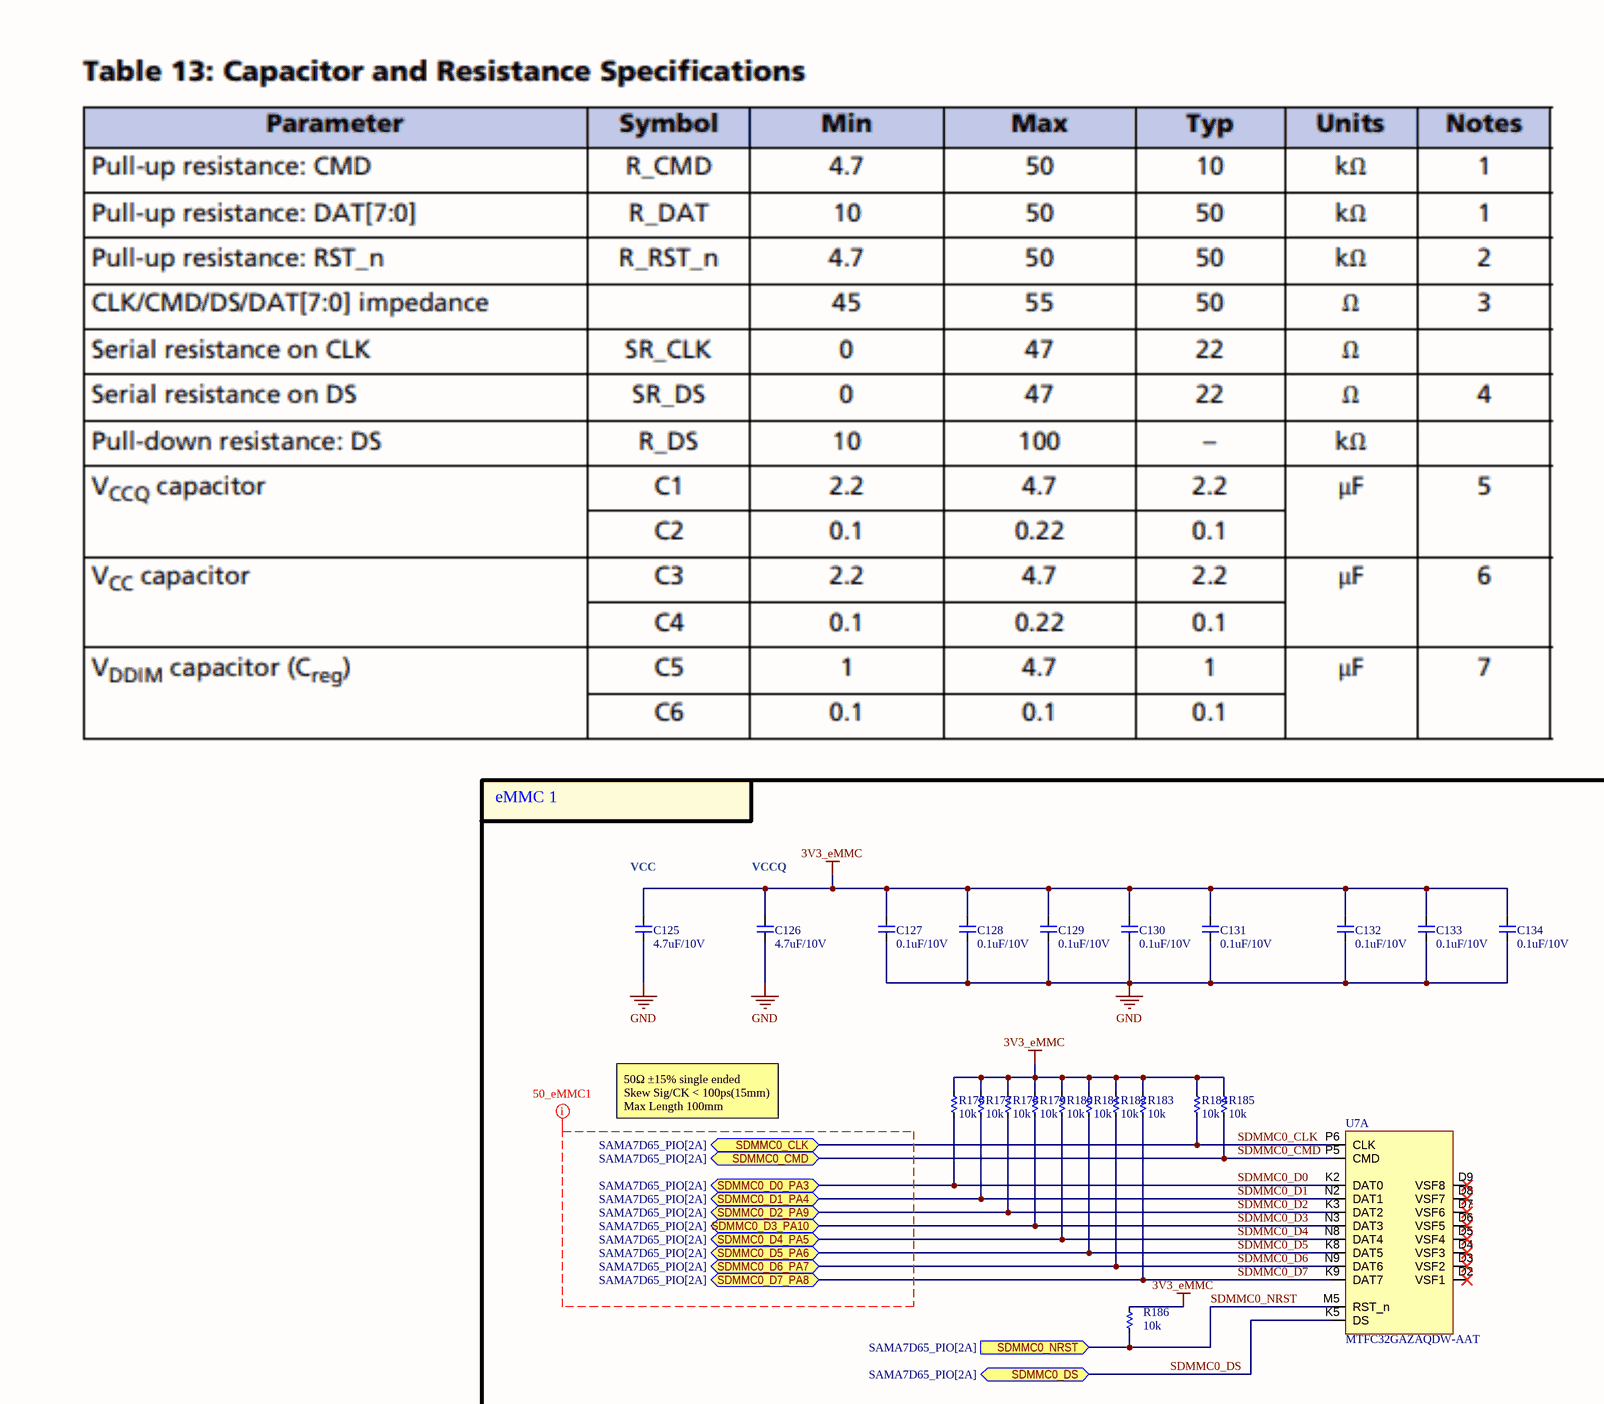
[diagram p11: eMMC.SchDoc, top left]
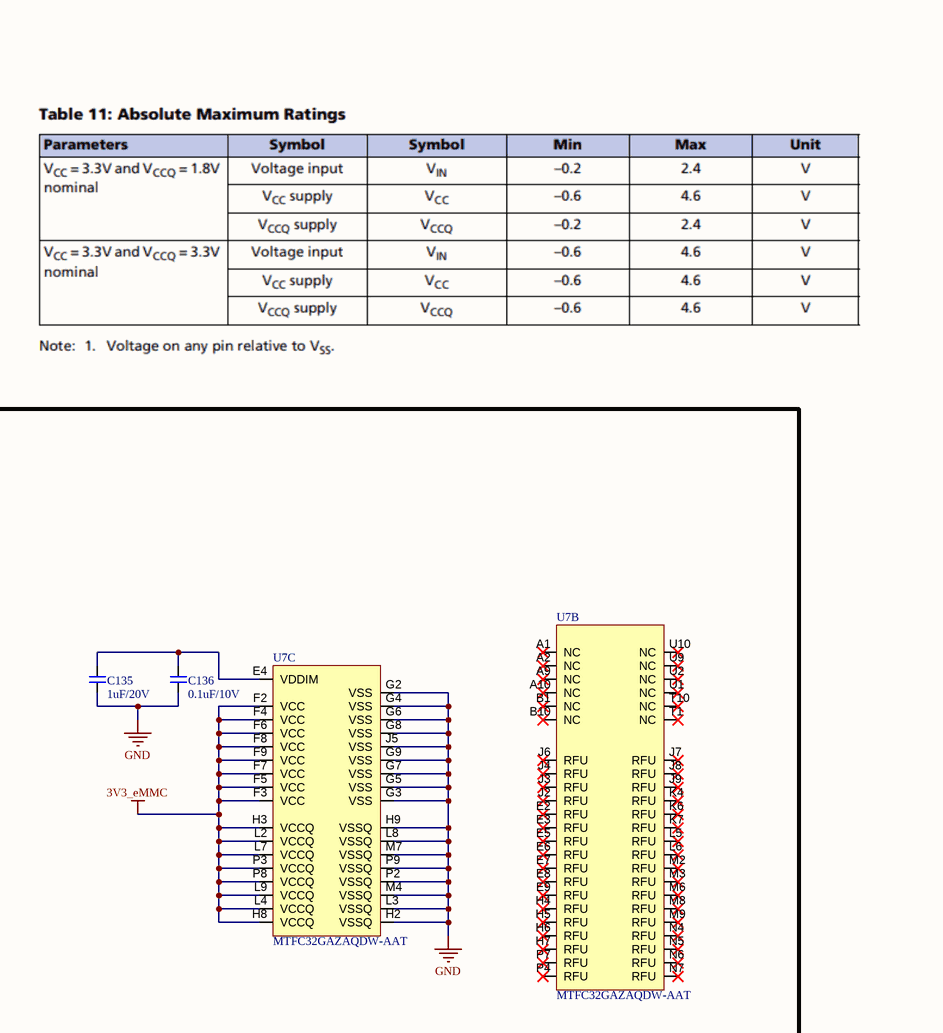
[diagram p12: eMMC.SchDoc, top middle]
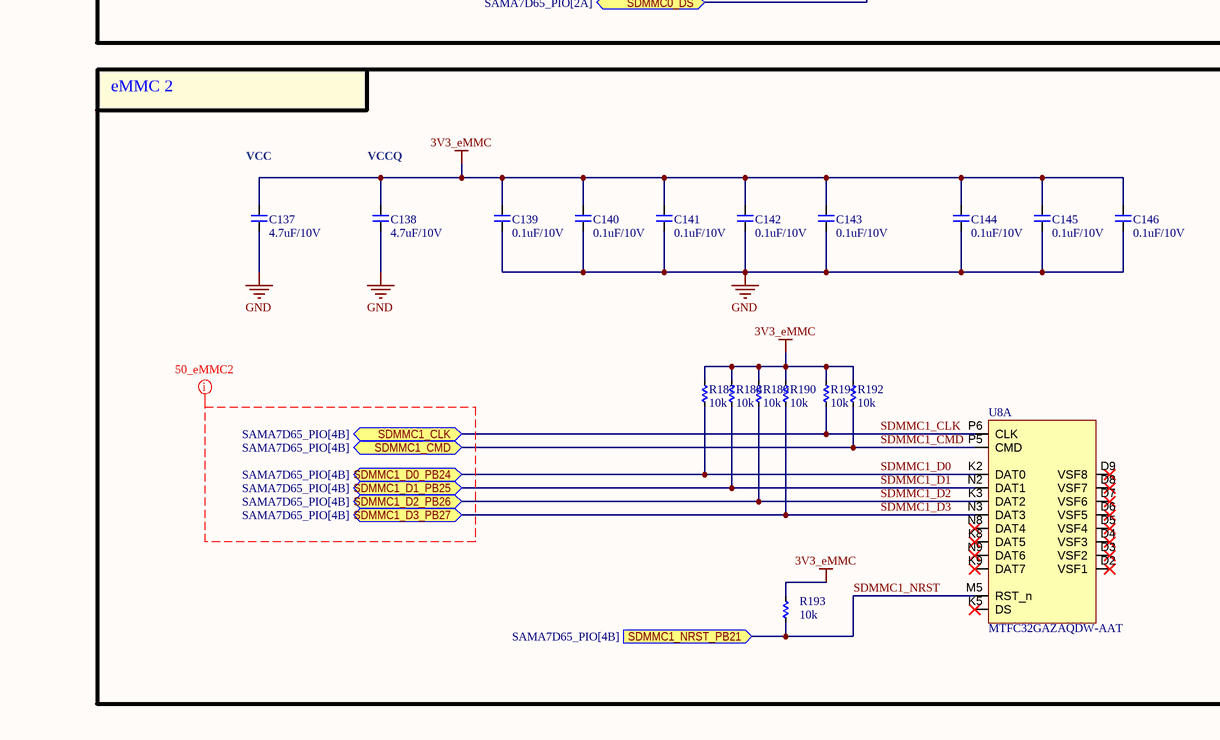
[diagram p13: eMMC.SchDoc, bottom left]
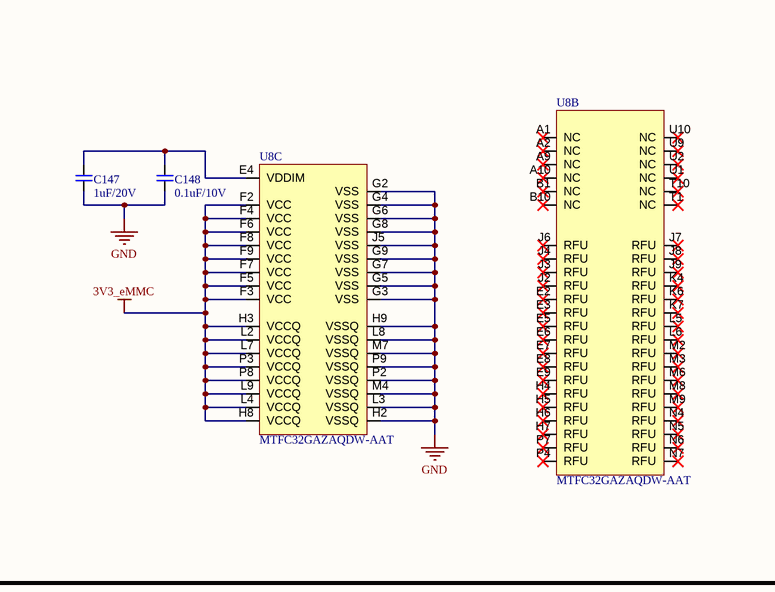
[diagram p14: eMMC.SchDoc, bottom middle]
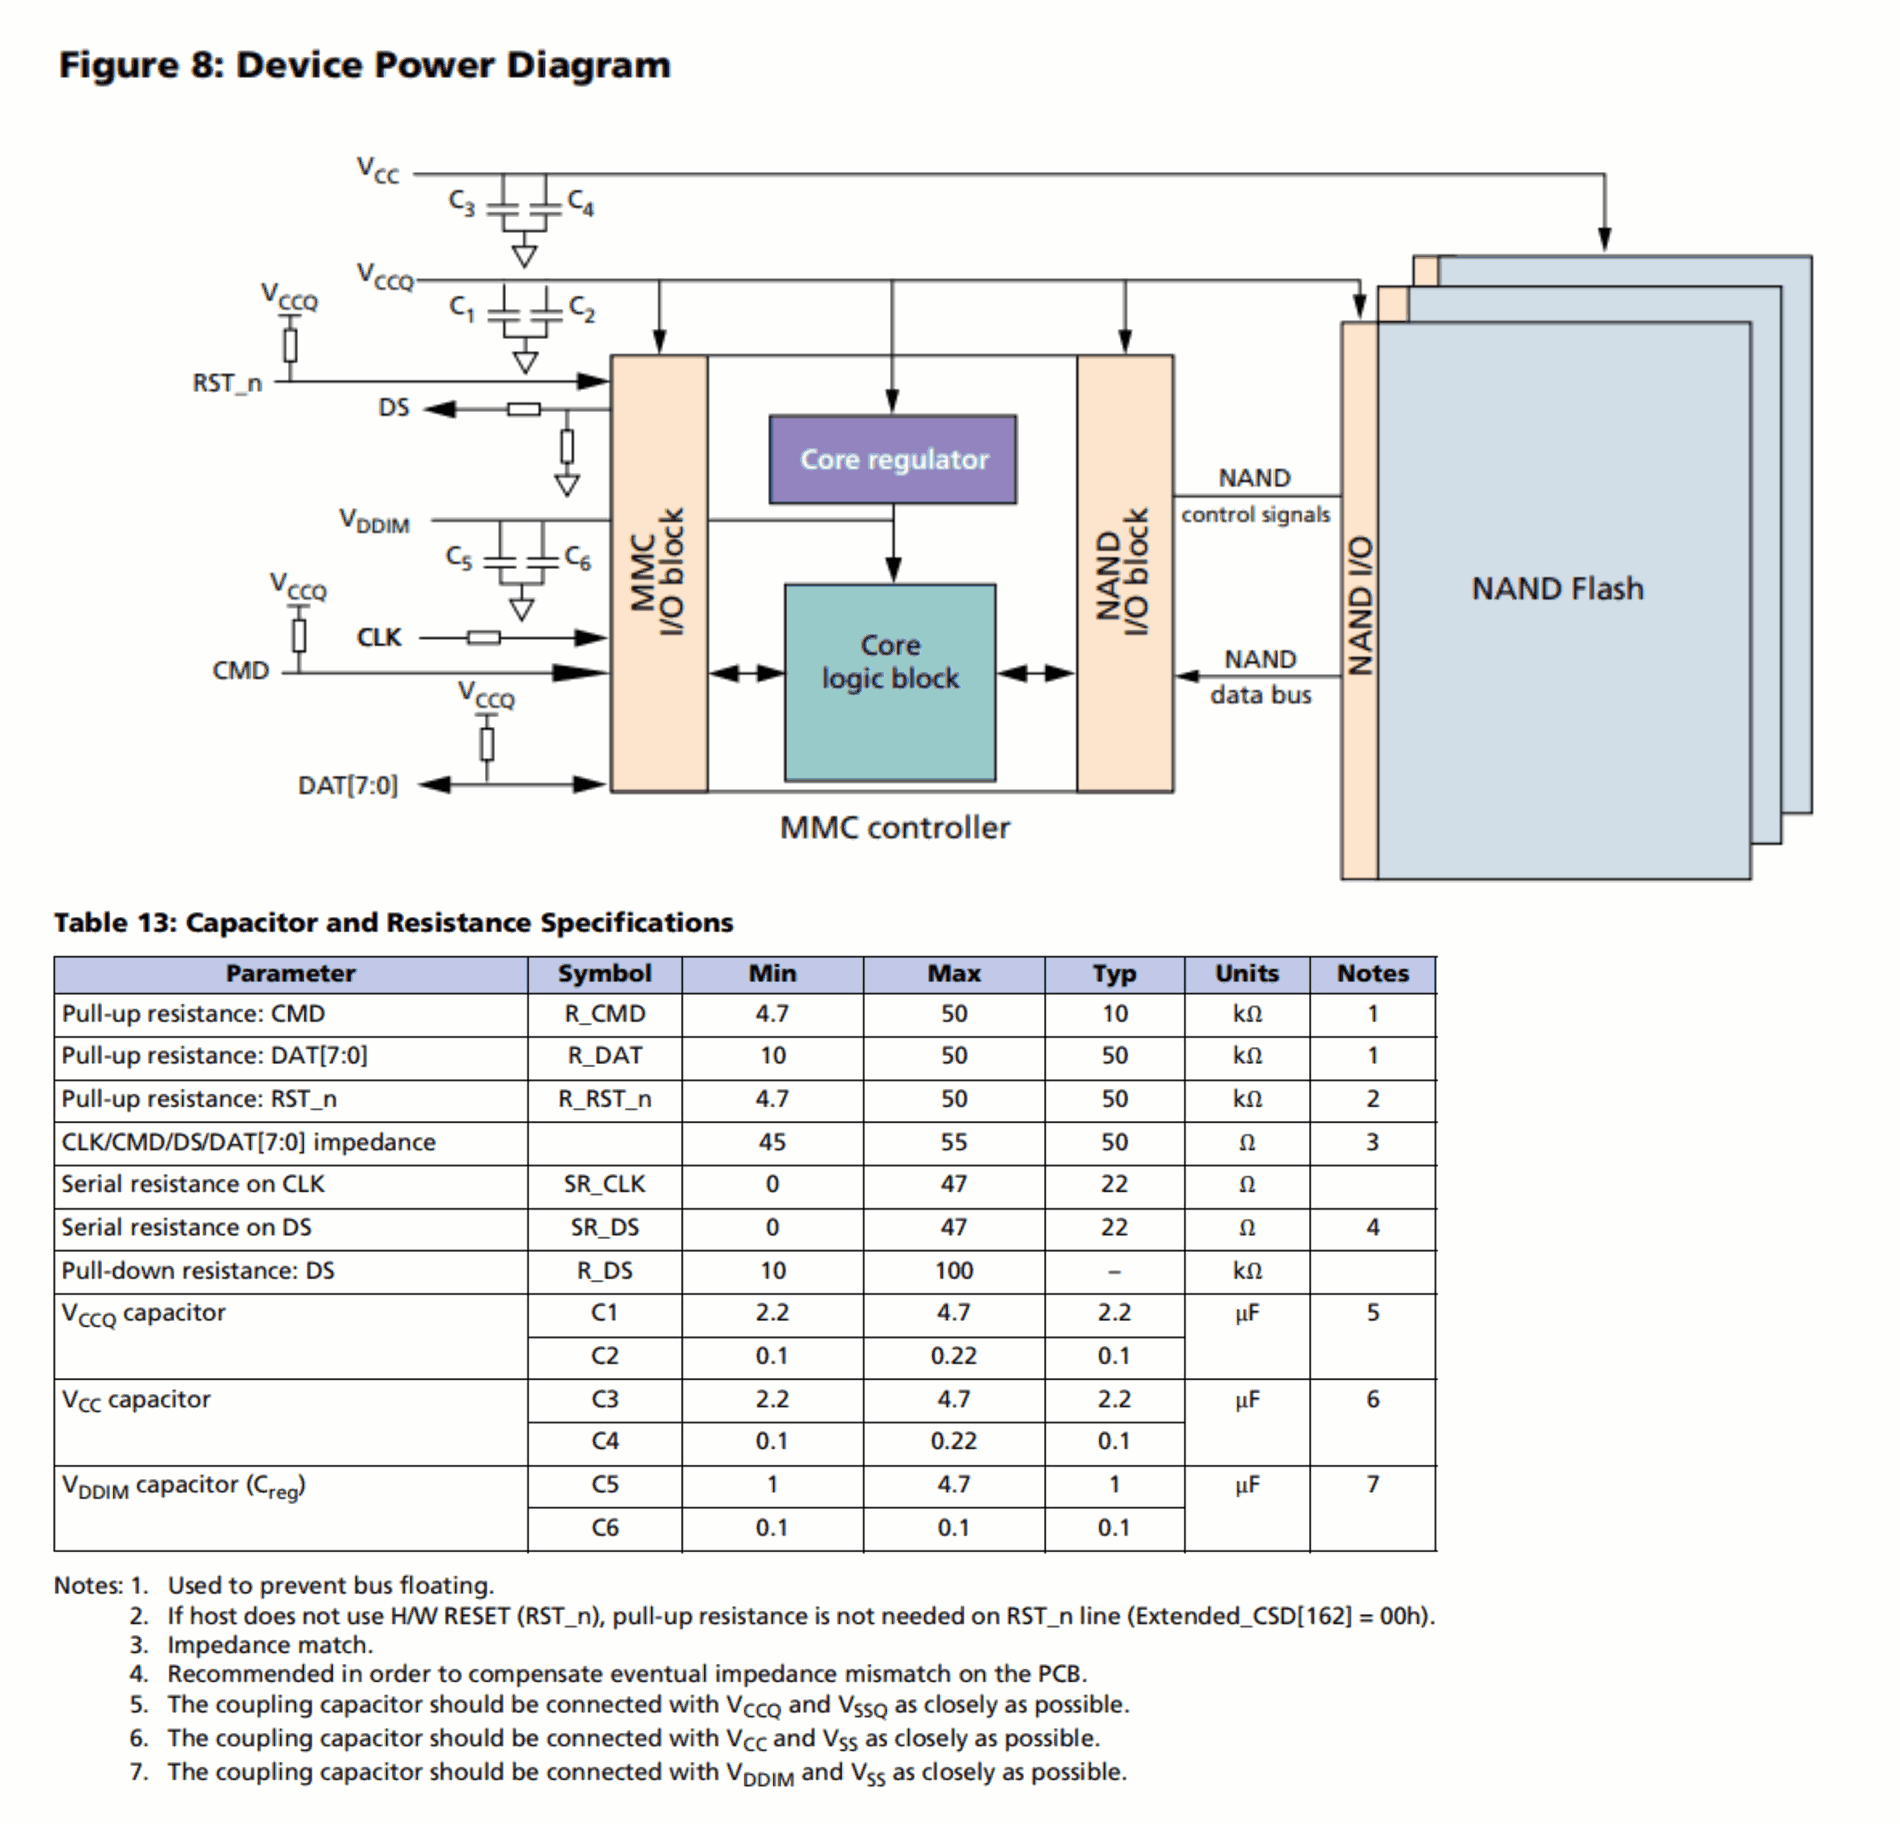
[diagram p15: eMMC.SchDoc, bottom right]

### Parts
C125  4.7uF/10V  [CAP_C_1005X50_L]
C126  4.7uF/10V  [CAP_C_1005X50_L]
C127  0.1uF/10V  [CAP_C_1005X50_L]
C128  0.1uF/10V  [CAP_C_1005X50_L]
C129  0.1uF/10V  [CAP_C_1005X50_L]
C130  0.1uF/10V  [CAP_C_1005X50_L]
C131  0.1uF/10V  [CAP_C_1005X50_L]
C132  0.1uF/10V  [CAP_C_1005X50_L]
C133  0.1uF/10V  [CAP_C_1005X50_L]
C134  0.1uF/10V  [CAP_C_1005X50_L]
C135  1uF/20V  [CAP_C_1005X50_L]
C136  0.1uF/10V  [CAP_C_1005X50_L]
C137  4.7uF/10V  [CAP_C_1005X50_L]
C138  4.7uF/10V  [CAP_C_1005X50_L]
C139  0.1uF/10V  [CAP_C_1005X50_L]
C140  0.1uF/10V  [CAP_C_1005X50_L]
C141  0.1uF/10V  [CAP_C_1005X50_L]
C142  0.1uF/10V  [CAP_C_1005X50_L]
C143  0.1uF/10V  [CAP_C_1005X50_L]
C144  0.1uF/10V  [CAP_C_1005X50_L]
C145  0.1uF/10V  [CAP_C_1005X50_L]
C146  0.1uF/10V  [CAP_C_1005X50_L]
C147  1uF/20V  [CAP_C_1005X50_L]
C148  0.1uF/10V  [CAP_C_1005X50_L]
R176  10k  [RES_C_1005x30_L]
R177  10k  [RES_C_1005x30_L]
R178  10k  [RES_C_1005x30_L]
R179  10k  [RES_C_1005x30_L]
R180  10k  [RES_C_1005x30_L]
R181  10k  [RES_C_1005x30_L]
R182  10k  [RES_C_1005x30_L]
R183  10k  [RES_C_1005x30_L]
R184  10k  [RES_C_1005x30_L]
R185  10k  [RES_C_1005x30_L]
R186  10k  [RES_C_1005x30_L]
R187  10k  [RES_C_1005x30_L]
R188  10k  [RES_C_1005x30_L]
R189  10k  [RES_C_1005x30_L]
R190  10k  [RES_C_1005x30_L]
R191  10k  [RES_C_1005x30_L]
R192  10k  [RES_C_1005x30_L]
R193  10k  [RES_C_1005x30_L]
U7  MTFC32GAZAQDW-AAT  [BGA_100_C_100P_10X17_1400X1800X150]  (parts A,B,C of 3)
U8  MTFC32GAZAQDW-AAT  [BGA_100_C_100P_10X17_1400X1800X150]  (parts A,B,C of 3)

### Blocks framed on the sheet
eMMC 1: C125-C136 R176-R186 U7
eMMC 2: C137-C148 R187-R193 U8

### Ports
SDMMC0_CLK (bidir, see SAMA7D65_PIO[2A]), SDMMC0_CMD (bidir, see SAMA7D65_PIO[2A]), SDMMC0_D0_PA3 (bidir, see SAMA7D65_PIO[2A]), SDMMC0_D1_PA4 (bidir, see SAMA7D65_PIO[2A]), SDMMC0_D2_PA9 (bidir, see SAMA7D65_PIO[2A]), SDMMC0_D3_PA10 (bidir, see SAMA7D65_PIO[2A]), SDMMC0_D4_PA5 (bidir, see SAMA7D65_PIO[2A]), SDMMC0_D5_PA6 (bidir, see SAMA7D65_PIO[2A]), SDMMC0_D6_PA7 (bidir, see SAMA7D65_PIO[2A]), SDMMC0_D7_PA8 (bidir, see SAMA7D65_PIO[2A]), SDMMC0_DS (bidir, see SAMA7D65_PIO[2A]), SDMMC0_NRST (in, see SAMA7D65_PIO[2A]), SDMMC1_CLK (bidir, see SAMA7D65_PIO[4B]), SDMMC1_CMD (bidir, see SAMA7D65_PIO[4B]), SDMMC1_D0_PB24 (bidir, see SAMA7D65_PIO[4B]), SDMMC1_D1_PB25 (bidir, see SAMA7D65_PIO[4B]), SDMMC1_D2_PB26 (bidir, see SAMA7D65_PIO[4B]), SDMMC1_D3_PB27 (bidir, see SAMA7D65_PIO[4B]), SDMMC1_NRST_PB21 (in, see SAMA7D65_PIO[4B])

### Nets
3V3_eMMC: C125.2 C126.2 C127.2 C128.2 C129.2 C130.2 C131.2 C132.2 C133.2 C134.2 C137.2 C138.2 C139.2 C140.2 C141.2 C142.2 C143.2 C144.2 C145.2 C146.2 R176.1 R177.1 R178.1 R179.1 R180.1 R181.1 R182.1 R183.1 R184.1 R185.1 R186.1 R187.1 R188.1 R189.1 R190.1 R191.1 R192.1 R193.1 U7.F2(VCC) U7.F3(VCC) U7.F4(VCC) U7.F5(VCC) U7.F6(VCC) U7.F7(VCC) U7.F8(VCC) U7.F9(VCC) U7.H3(VCCQ) U7.H8(VCCQ) U7.L2(VCCQ) U7.L4(VCCQ) U7.L7(VCCQ) U7.L9(VCCQ) U7.P3(VCCQ) U7.P8(VCCQ) U8.F2(VCC) U8.F3(VCC) U8.F4(VCC) U8.F5(VCC) U8.F6(VCC) U8.F7(VCC) U8.F8(VCC) U8.F9(VCC) U8.H3(VCCQ) U8.H8(VCCQ) U8.L2(VCCQ) U8.L4(VCCQ) U8.L7(VCCQ) U8.L9(VCCQ) U8.P3(VCCQ) U8.P8(VCCQ)
GND: C125.1 C126.1 C127.1 C128.1 C129.1 C130.1 C131.1 C132.1 C133.1 C134.1 C135.1 C136.1 C137.1 C138.1 C139.1 C140.1 C141.1 C142.1 C143.1 C144.1 C145.1 C146.1 C147.1 C148.1 U7.G2(VSS) U7.G3(VSS) U7.G4(VSS) U7.G5(VSS) U7.G6(VSS) U7.G7(VSS) U7.G8(VSS) U7.G9(VSS) U7.H2(VSSQ) U7.H9(VSSQ) U7.J5(VSS) U7.L3(VSSQ) U7.L8(VSSQ) U7.M4(VSSQ) U7.M7(VSSQ) U7.P2(VSSQ) U7.P9(VSSQ) U8.G2(VSS) U8.G3(VSS) U8.G4(VSS) U8.G5(VSS) U8.G6(VSS) U8.G7(VSS) U8.G8(VSS) U8.G9(VSS) U8.H2(VSSQ) U8.H9(VSSQ) U8.J5(VSS) U8.L3(VSSQ) U8.L8(VSSQ) U8.M4(VSSQ) U8.M7(VSSQ) U8.P2(VSSQ) U8.P9(VSSQ)
SDMMC0_CLK: R184.2 U7.P6(CLK) ; port SDMMC0_CLK
SDMMC0_CMD: R185.2 U7.P5(CMD) ; port SDMMC0_CMD
SDMMC0_D0: R176.2 U7.K2(DAT0) ; port SDMMC0_D0_PA3
SDMMC0_D1: R177.2 U7.N2(DAT1) ; port SDMMC0_D1_PA4
SDMMC0_D2: R178.2 U7.K3(DAT2) ; port SDMMC0_D2_PA9
SDMMC0_D3: R179.2 U7.N3(DAT3) ; port SDMMC0_D3_PA10
SDMMC0_D4: R180.2 U7.N8(DAT4) ; port SDMMC0_D4_PA5
SDMMC0_D5: R181.2 U7.K8(DAT5) ; port SDMMC0_D5_PA6
SDMMC0_D6: R182.2 U7.N9(DAT6) ; port SDMMC0_D6_PA7
SDMMC0_D7: R183.2 U7.K9(DAT7) ; port SDMMC0_D7_PA8
SDMMC0_DS: U7.K5(DS) ; port SDMMC0_DS
SDMMC0_NRST: R186.2 U7.M5(RST_n) ; port SDMMC0_NRST
SDMMC1_CLK: R191.2 U8.P6(CLK) ; port SDMMC1_CLK
SDMMC1_CMD: R192.2 U8.P5(CMD) ; port SDMMC1_CMD
SDMMC1_D0: R187.2 U8.K2(DAT0) ; port SDMMC1_D0_PB24
SDMMC1_D1: R188.2 U8.N2(DAT1) ; port SDMMC1_D1_PB25
SDMMC1_D2: R189.2 U8.K3(DAT2) ; port SDMMC1_D2_PB26
SDMMC1_D3: R190.2 U8.N3(DAT3) ; port SDMMC1_D3_PB27
SDMMC1_NRST: R193.2 U8.M5(RST_n) ; port SDMMC1_NRST_PB21
NetC135_2: C135.2 C136.2 U7.E4(VDDIM)
NetC147_2: C147.2 C148.2 U8.E4(VDDIM)

Not connected (* = marked no-connect by the designer): U7 A1(NC)* A2(NC)* A9(NC)* A10(NC)* B1(NC)* B10(NC)* D2(VSF1)* D3(VSF2)* D4(VSF3)* D5(VSF4)* D6(VSF5)* D7(VSF6)* D8(VSF7)* D9(VSF8)* E2(RFU)* E3(RFU)* E5(RFU)* E6(RFU)* E7(RFU)* E8(RFU)* E9(RFU)* H4(RFU)* H5(RFU)* H6(RFU)* H7(RFU)* J2(RFU)* J3(RFU)* J4(RFU)* J6(RFU)* J7(RFU)* J8(RFU)* J9(RFU)* K4(RFU)* K6(RFU)* K7(RFU)* L5(RFU)* L6(RFU)* M2(RFU)* M3(RFU)* M6(RFU)* M8(RFU)* M9(RFU)* N4(RFU)* N5(RFU)* N6(RFU)* N7(RFU)* P4(RFU)* P7(RFU)* T1(NC)* T10(NC)* U1(NC)* U2(NC)* U9(NC)* U10(NC)*; U8 A1(NC)* A2(NC)* A9(NC)* A10(NC)* B1(NC)* B10(NC)* D2(VSF1)* D3(VSF2)* D4(VSF3)* D5(VSF4)* D6(VSF5)* D7(VSF6)* D8(VSF7)* D9(VSF8)* E2(RFU)* E3(RFU)* E5(RFU)* E6(RFU)* E7(RFU)* E8(RFU)* E9(RFU)* H4(RFU)* H5(RFU)* H6(RFU)* H7(RFU)* J2(RFU)* J3(RFU)* J4(RFU)* J6(RFU)* J7(RFU)* J8(RFU)* J9(RFU)* K4(RFU)* K5(DS)* K6(RFU)* K7(RFU)* K8(DAT5)* K9(DAT7)* L5(RFU)* L6(RFU)* M2(RFU)* M3(RFU)* M6(RFU)* M8(RFU)* M9(RFU)* N4(RFU)* N5(RFU)* N6(RFU)* N7(RFU)* N8(DAT4)* N9(DAT6)* P4(RFU)* P7(RFU)* T1(NC)* T10(NC)* U1(NC)* U2(NC)* U9(NC)* U10(NC)*

### Layout directives
net class 50_eMMC1: (no net found under the mark)
net class 50_eMMC2: (no net found under the mark)

### Notes on the sheet
- (near C125) VCC
- (near C126) VCCQ
- 50Ω ±15% single ended
  Skew Sig/CK < 100ps(15mm)
  Max Length 100mm
- (near C137) VCC
- (near C138) VCCQ
- Project:
- Page Contents:
- Revision:
- Design:
- Date:
- Size:
- A3
- Document Number:
- Sheet:
- of

### Library data of the parts
C125-C148 = _CAP_C_2: CAP CHIP
R176-R193 = _RES_B_2: RES

## Sheet EEPROM.SchDoc
size A3; SheetNumber: 12; SheetTotal: 23
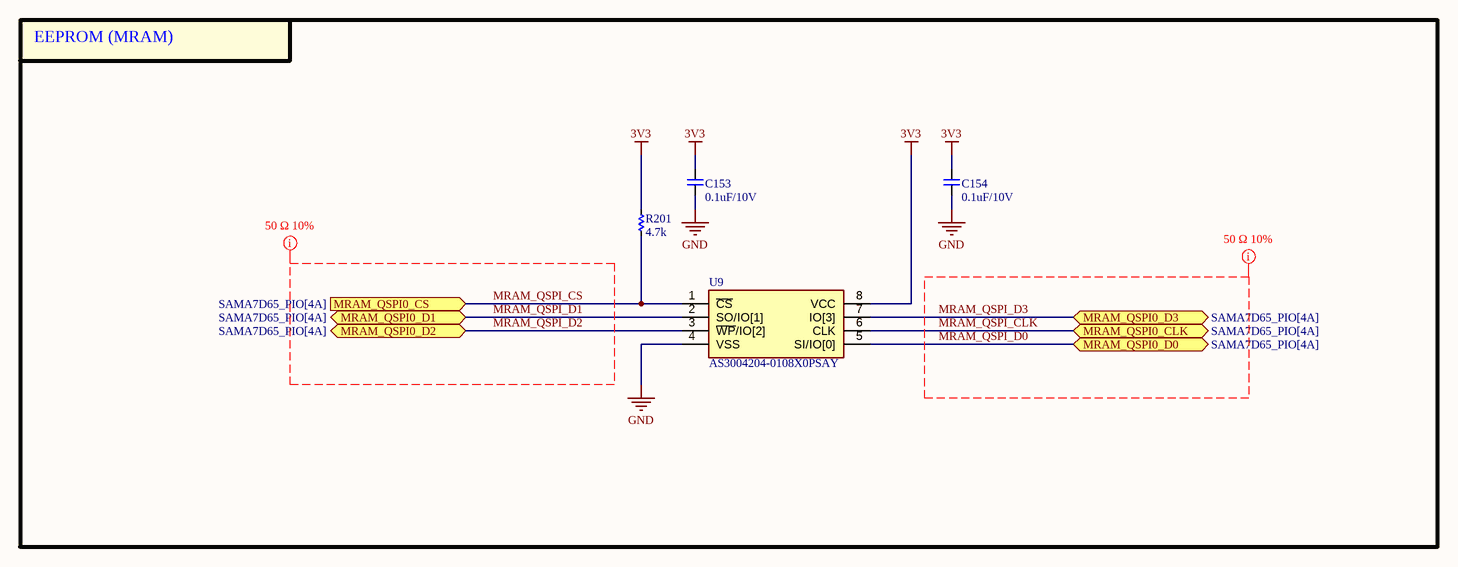
[diagram p16: EEPROM.SchDoc]

### Parts
C153  0.1uF/10V  [CAP_C_1005X50_L]
C154  0.1uF/10V  [CAP_C_1005X50_L]
R201  4.7k  [RES_C_1005x30_L]
U9  AS3004204-0108X0PSAY  [SOIC127P790X216-8N]

### Blocks framed on the sheet
EEPROM (MRAM): C153 C154 R201 U9

### Ports
MRAM_QSPI0_CLK (bidir, see SAMA7D65_PIO[4A]), MRAM_QSPI0_CS (in, see SAMA7D65_PIO[4A]), MRAM_QSPI0_D0 (bidir, see SAMA7D65_PIO[4A]), MRAM_QSPI0_D1 (bidir, see SAMA7D65_PIO[4A]), MRAM_QSPI0_D2 (bidir, see SAMA7D65_PIO[4A]), MRAM_QSPI0_D3 (bidir, see SAMA7D65_PIO[4A])

### Nets
3V3: C153.2 C154.2 R201.1 U9.8(VCC)
GND: C153.1 C154.1 U9.4(VSS)
MRAM_QSPI_CLK: U9.6(CLK) ; port MRAM_QSPI0_CLK
MRAM_QSPI_CS: R201.2 U9.1(~{CS}) ; port MRAM_QSPI0_CS
MRAM_QSPI_D0: U9.5(SI/IO[0]) ; port MRAM_QSPI0_D0
MRAM_QSPI_D1: U9.2(SO/IO[1]) ; port MRAM_QSPI0_D1
MRAM_QSPI_D2: U9.3(~{WP}/IO[2]) ; port MRAM_QSPI0_D2
MRAM_QSPI_D3: U9.7(IO[3]) ; port MRAM_QSPI0_D3

### Layout directives
net class QSPI: MRAM_QSPI_CLK, MRAM_QSPI_CS, MRAM_QSPI_D0, MRAM_QSPI_D1, MRAM_QSPI_D2, MRAM_QSPI_D3

### Notes on the sheet
- Project:
- Page Contents:
- Revision:
- Design:
- Date:
- Size:
- A3
- Document Number:
- Sheet:
- of

### Library data of the parts
C153 C154 = _CAP_C_2: CAP CHIP
R201 = _RES_B_2: RES
U9 = AS3004204-0108X0PSAY: MRAM Avalanche High Performance Serial P-SRAM 4Mb in SOIC8 package with QSPI - 108MHz interface, 3V, -40 C to 105 C; Manufacturer_Name: Avalanche Technology; Geometry.Height: 2.16mm; Manufacturer_Part_Number: AS3004204-0108X0PSAY; Mouser Part Number: 793-30042040108X0PSY; Mouser Price/Stock: https://www.mouser.co.uk/ProductDetail/Avalanche-Technology/AS3004204-0108X0PSAY/?qs=eP2BKZSCXI7G0ggegRejGg%3D%3D; Arrow Part Number: *; Arrow Price/Stock: *; Datasheet Link: https://www.mouser.ph/ProductDetail/Avalanche-Technology/AS3004204-0108X0PSAY?qs=eP2BKZSCXI7G0ggegRejGg%3D%3D

## Sheet USB_SWITCH.SchDoc
size A3; SheetNumber: 13; SheetTotal: 23
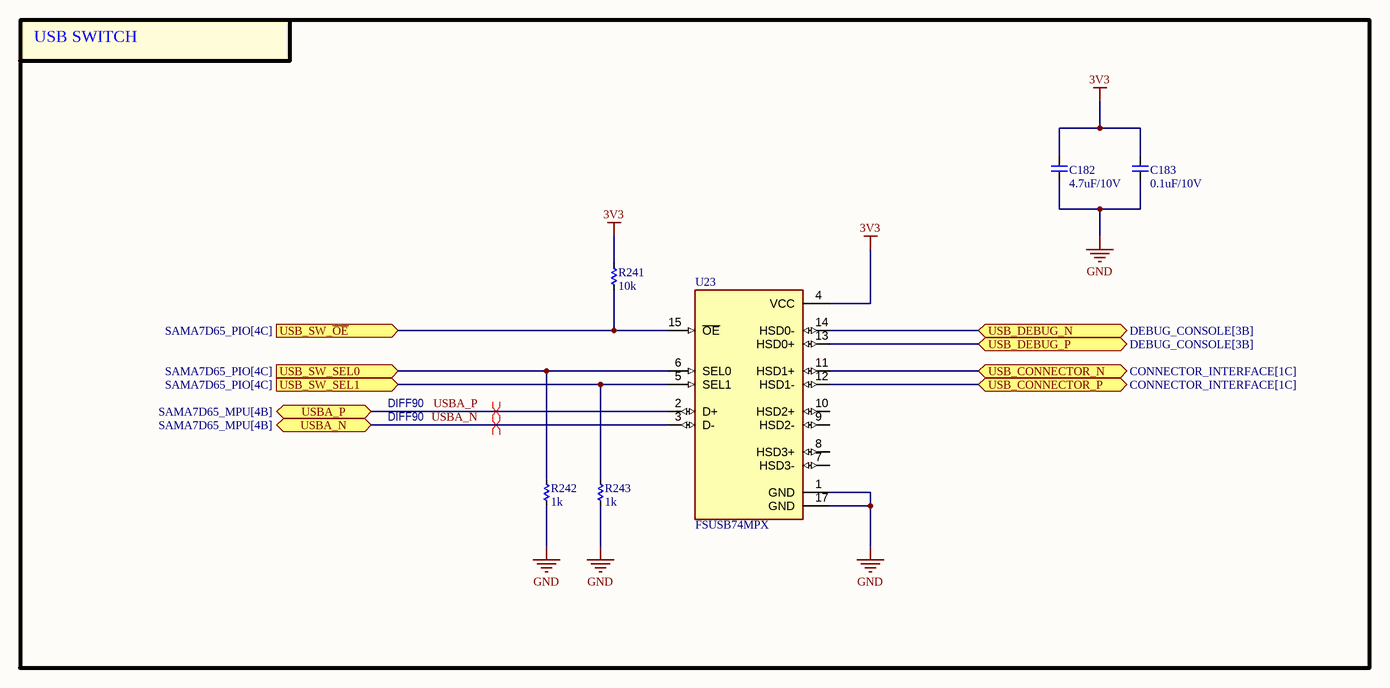
[diagram p17: USB_SWITCH.SchDoc]

### Parts
C182  4.7uF/10V  [CAP_C_1005X50_L]
C183  0.1uF/10V  [CAP_C_1005X50_L]
R241  10k  [RES_C_1005X40]
R242  1k  [RES_C_1005X40]
R243  1k  [RES_C_1005X40]
U23  FSUSB74MPX  [QFN50P300X300X80-17N]

### Blocks framed on the sheet
USB SWITCH: C182 C183 R241-R243 U23

### Ports
USB_CONNECTOR_N (bidir, see CONNECTOR_INTERFACE[1C]), USB_CONNECTOR_P (bidir, see CONNECTOR_INTERFACE[1C]), USB_DEBUG_N (bidir, see DEBUG_CONSOLE[3B]), USB_DEBUG_P (bidir, see DEBUG_CONSOLE[3B]), USB_SW_SEL0 (in, see SAMA7D65_PIO[4C]), USB_SW_SEL1 (in, see SAMA7D65_PIO[4C]), USB_SW_~{OE} (in, see SAMA7D65_PIO[4C]), USBA_N (bidir, see SAMA7D65_MPU[4B]), USBA_P (bidir, see SAMA7D65_MPU[4B])

### Nets
3V3: C182.2 C183.2 R241.2 U23.4(VCC)
GND: C182.1 C183.1 R242.1 R243.1 U23.1(GND) U23.17(GND)
USB_CONNECTOR_N: U23.11(HSD1+) ; port USB_CONNECTOR_N
USB_CONNECTOR_P: U23.12(HSD1-) ; port USB_CONNECTOR_P
USB_DEBUG_N: U23.14(HSD0-) ; port USB_DEBUG_N
USB_DEBUG_P: U23.13(HSD0+) ; port USB_DEBUG_P
USBA_N: U23.3(D-) ; port USBA_N
USBA_P: U23.2(D+) ; port USBA_P
NetR142_2: R241.1 U23.15(~{OE}) ; port USB_SW_~{OE}
NetR143_2: R242.2 U23.6(SEL0) ; port USB_SW_SEL0
NetR144_2: R243.2 U23.5(SEL1) ; port USB_SW_SEL1

Not connected (* = marked no-connect by the designer): U23 7(HSD3-) 8(HSD3+) 9(HSD2-) 10(HSD2+)

### Layout directives
differential pair; differential pair class DIFF90; net class DIFF90; rule Matched Net Lengths [Tolerance = 4mil]: USBA_N, USBA_P

### Notes on the sheet
- Project:
- Page Contents:
- Revision:
- Design:
- Date:
- Size:
- A3
- Document Number:
- Sheet:
- of

### Library data of the parts
C182 C183 = _CAP_C_2: CAP CHIP
R241-R243 = _RES_B_2: RES
U23 = IC_USB_SW_FSUSB74MPX: USB Switch IC 1 Channel 16-MLP (3x3); MF: ON Semiconductor; SnapEDA_Link: https://www.snapeda.com/parts/FSUSB74MPX/Onsemi/view-part/?ref=snap; Package: WQFN-16 ON Semiconductor; Value: *; MP: FSUSB74MPX; Check_prices: https://www.snapeda.com/parts/FSUSB74MPX/Onsemi/view-part/?ref=eda

## Sheet DEBUG_CONSOLE.SchDoc
size A3; SheetNumber: 14; SheetTotal: 23
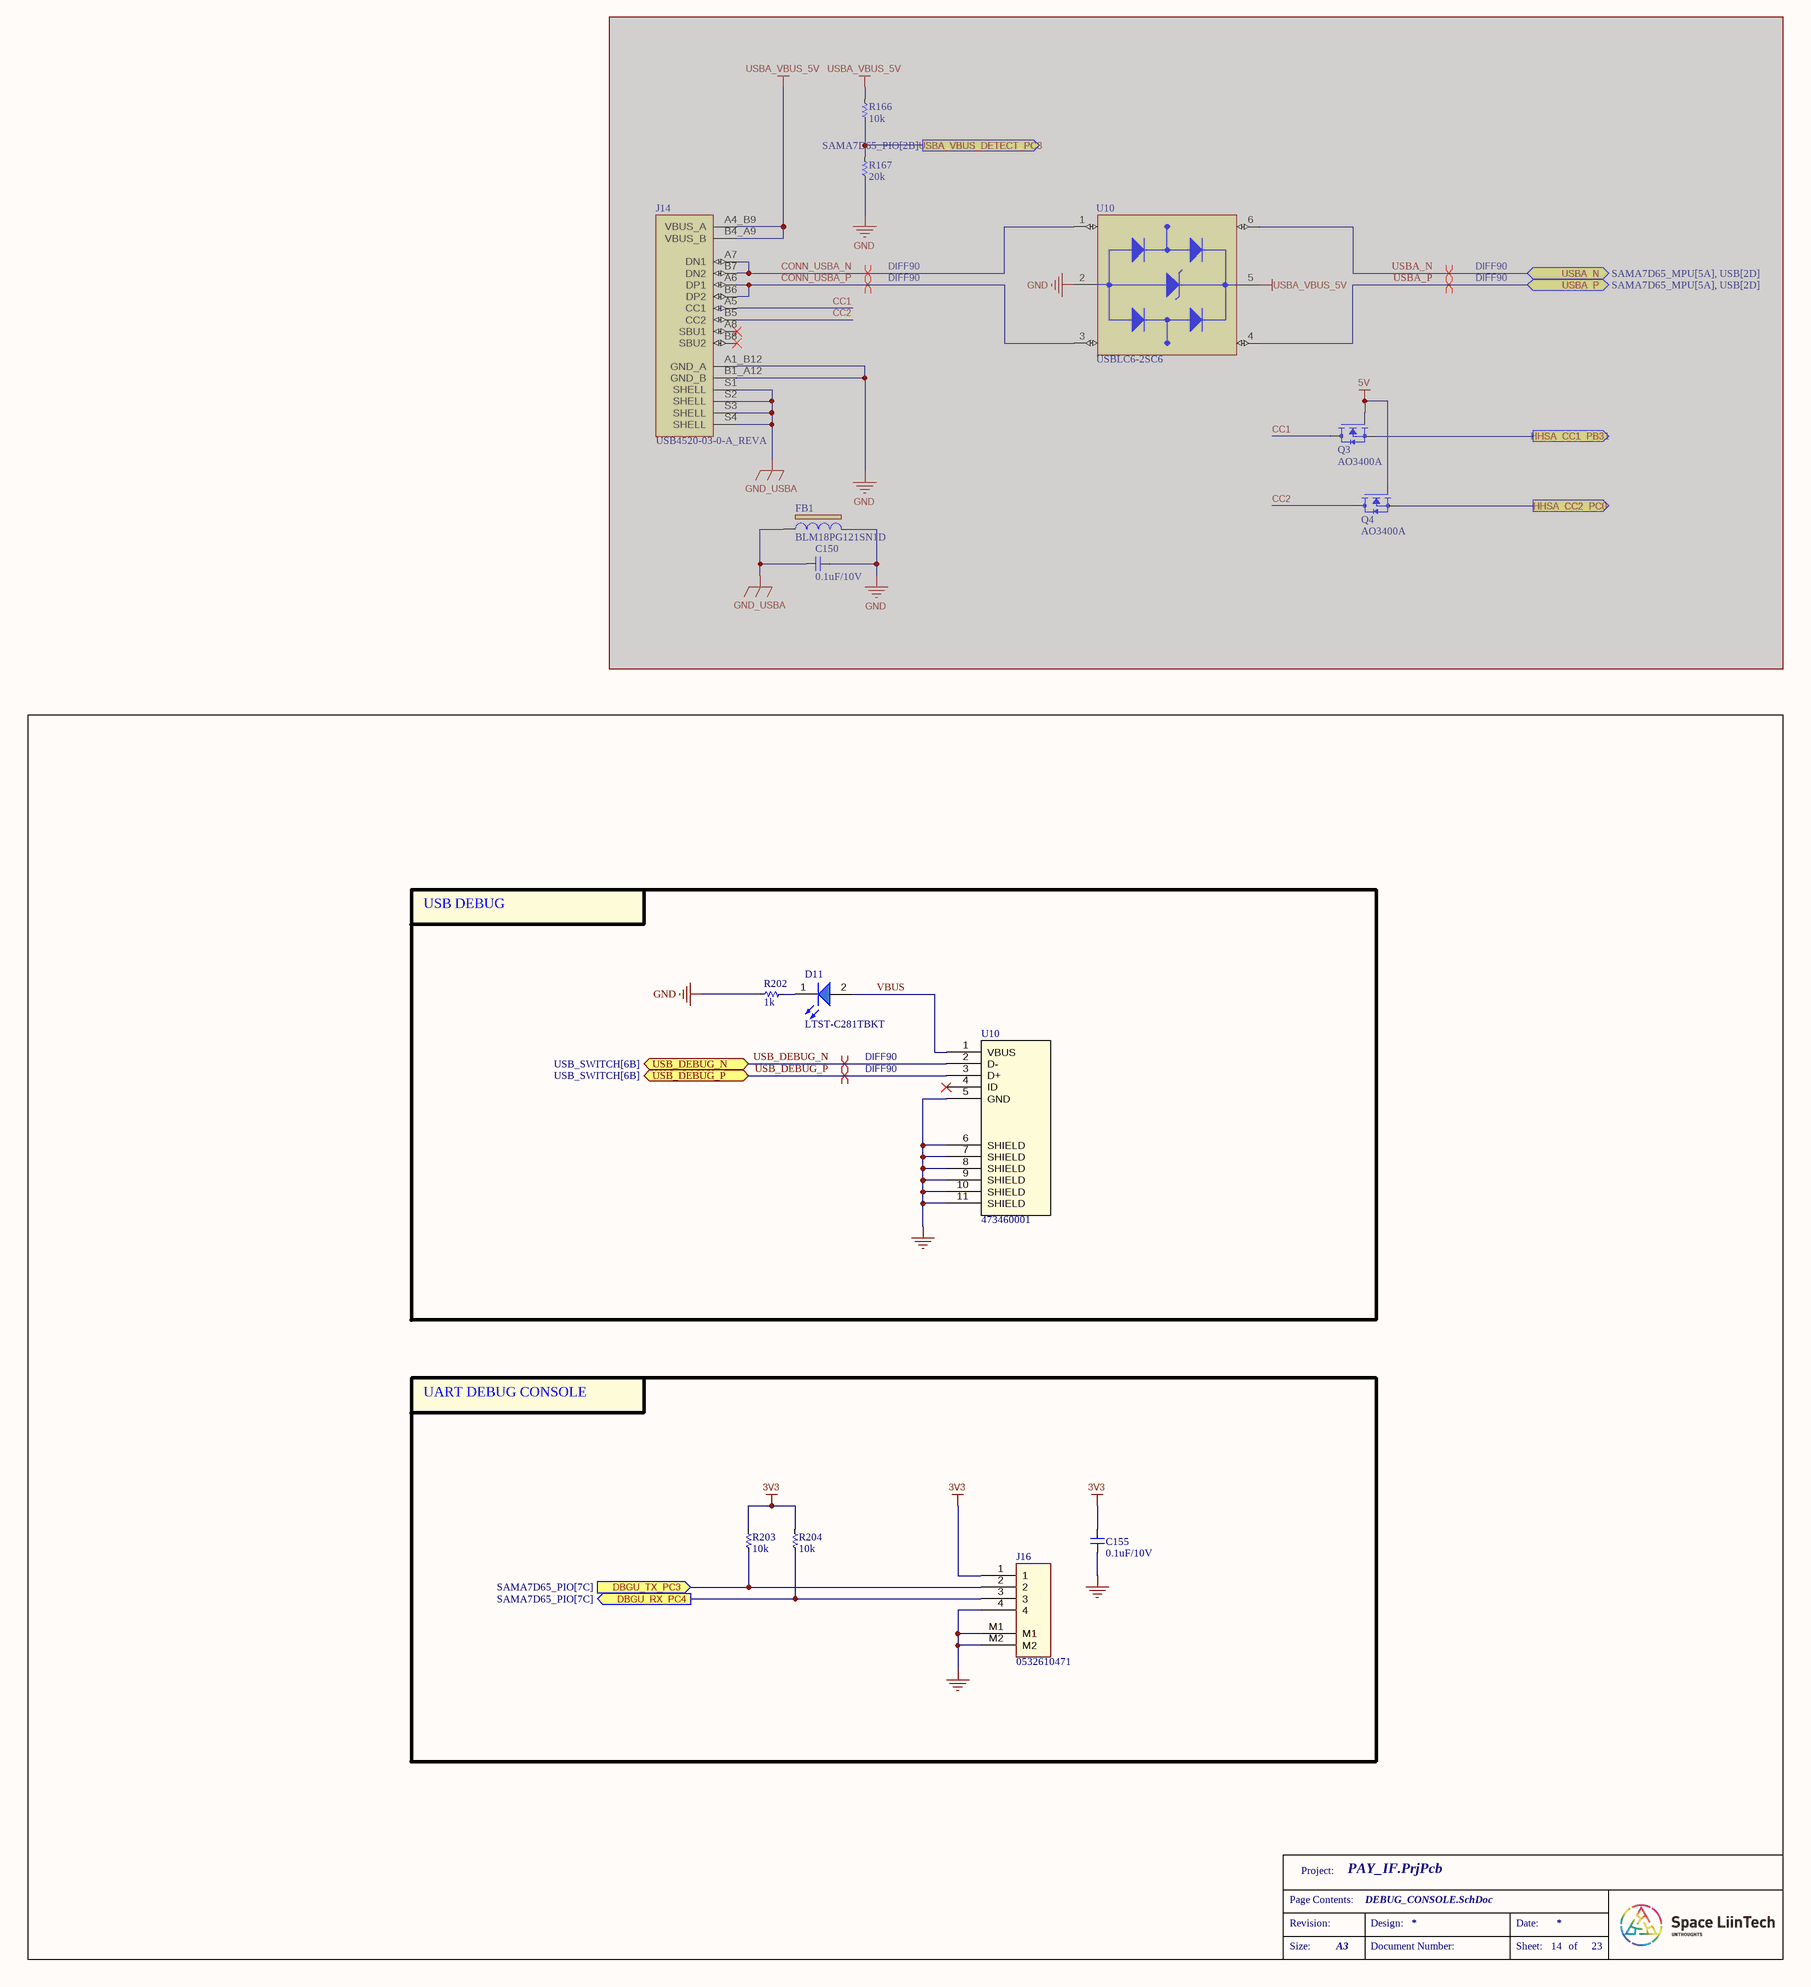
[diagram p18: DEBUG_CONSOLE.SchDoc]

### Parts
(Parts that share a designator on the sheet are numbered #1, #2 ... from top to bottom, then left to right.)
C150#2  0.1uF/10V  [CAP_C_1005X50_L]  (masked out: inside a compile mask, not in the netlist)
C155  0.1uF/10V  [CAP_C_1005X50_L]
D11  LTST-C281TBKT  [LED_0402]
FB1#2  BLM18PG121SN1D  [IND_BLM18_0603_MUR]  (masked out: inside a compile mask, not in the netlist)
J14#2  USB4520-03-0-A_REVA  [GCT_USB4520-03-0-A_REVA]  (masked out: inside a compile mask, not in the netlist)
J16  0532610471  [MOLEX_0532610471]
Q3  AO3400A  [SOT95P280X125-3N]  (masked out: inside a compile mask, not in the netlist)
Q4  AO3400A  [SOT95P280X125-3N]  (masked out: inside a compile mask, not in the netlist)
R166#2  10k  [RES_C_1005x30_L]  (masked out: inside a compile mask, not in the netlist)
R167#2  20k  [RES_C_0603X30]  (masked out: inside a compile mask, not in the netlist)
R202  1k  [RES_C_1005x30_L]
R203  10k  [RES_C_1005x30_L]
R204  10k  [RES_C_1005x30_L]
U10#1  USBLC6-2SC6  [SOT95P280X145-6N]  (masked out: inside a compile mask, not in the netlist)
U10#2  473460001  [47346-0001_MOL]

### Blocks framed on the sheet
USB DEBUG: D11 R202 U10#2
UART DEBUG CONSOLE: C155 J16 R203 R204

### Ports
DBGU_RX_PC4 (out, see SAMA7D65_PIO[7C]), DBGU_TX_PC3 (in, see SAMA7D65_PIO[7C]), HHSA_CC1_PB31 (out), HHSA_CC2_PC0 (out), USB_DEBUG_N (bidir, see USB_SWITCH[6B]), USB_DEBUG_P (bidir, see USB_SWITCH[6B]), USBA_N (bidir, see SAMA7D65_MPU[5A], USB[2D]), USBA_P (bidir, see SAMA7D65_MPU[5A], USB[2D]), USBA_VBUS_DETECT_PC8 (out, see SAMA7D65_PIO[2B])

### Nets
3V3: C155.2 J16.1 R203.1 R204.1
GND: C155.1 J16.4 J16.M1 J16.M2 R202.1 U10#2.5(GND) U10#2.6(SHIELD) U10#2.7(SHIELD) U10#2.8(SHIELD) U10#2.9(SHIELD) U10#2.10(SHIELD) U10#2.11(SHIELD)
FLEXCOM9_UART_RX_DEBUG: J16.3 R204.2 ; port DBGU_RX_PC4
FLEXCOM9_UART_TX_DEBUG: J16.2 R203.2 ; port DBGU_TX_PC3
USB_DEBUG_N: U10#2.2(D-) ; port USB_DEBUG_N
USB_DEBUG_P: U10#2.3(D+) ; port USB_DEBUG_P
VBUS: D11.2(A) U10#2.1(VBUS)
NetD11_1: D11.1(K) R202.2

Not connected (* = marked no-connect by the designer): U10#2 4(ID)*

### Layout directives
differential pair; differential pair class DIFF90; net class DIFF90; rule Matched Net Lengths [Tolerance = 4mil]: (no net found under the mark), USB_DEBUG_N, USB_DEBUG_P

### Notes on the sheet
- Project:
- Page Contents:
- Revision:
- Design:
- Date:
- Size:
- A3
- Document Number:
- Sheet:
- of

### Library data of the parts
C150#2 C155 = _CAP_C_2: CAP CHIP
D11 = LED_BLUE
FB1#2 = BLM18PG121SN1D: FERRITE BEAD 120 OHM 0603 1LN; Manufacturer_Name: Murata; Copyright: Copyright (C) 2025 Ultra Librarian. All rights reserved.; Manufacturer_Part_Number: BLM18PG121SN1D
J14#2 = USB4520-03-0-A_REVA: USB-C (USB TYPE-C) USB 2.0 Receptacle Connector 24 (16+8 Dummy) Position Board Edge, Cutout; Surface Mount; Through Hole, Right Angle; MF: Global Connector Technology; SnapEDA_Link: https://www.snapeda.com/parts/USB4520-03-0-A/Global+Connector+Technology/view-part/?ref=snap; Package: None; Value: *; MP: USB4520-03-0-A; Check_prices: https://www.snapeda.com/parts/USB4520-03-0-A/Global+Connector+Technology/view-part/?ref=eda
J16 = Header 4x1_2M
Q3 Q4 = AO3400A: N-Channel 30 V 5.7A (Ta) 1.4W (Ta) Surface Mount SOT-23-3; MF: Alpha & Omega Semiconductor; SnapEDA_Link: https://www.snapeda.com/parts/AO3400A/Alpha/view-part/?ref=snap; Package: SOT-23 Alpha &amp; Omega Semiconductor Inc.; Value: *; MP: AO3400A; Check_prices: https://www.snapeda.com/parts/AO3400A/Alpha/view-part/?ref=eda
R166#2 R167#2 R202-R204 = _RES_B_2: RES
U10#1 = USBLC6-2SC6: 17V Clamp 5A (8/20Âµs) Ipp Tvs Diode Surface Mount SOT-23-6; MF: STMicroelectronics; Value: *; SnapEDA_Link: https://www.snapeda.com/parts/USBLC6-2SC6/STMicroelectronics/view-part/?ref=snap; Check_prices: https://www.snapeda.com/parts/USBLC6-2SC6/STMicroelectronics/view-part/?ref=eda; Purchase-URL: https://pricing.snapeda.com/search/part/USBLC6-2SC6/?ref=eda; Price: None; Availability: In Stock; Package: SOT-23-6 STMicroelectronics; MP: USBLC6-2SC6
U10#2 = 473460001: Micro-USB B Receptacle with Flange, Bottom Mount, Surface Mount, Lead-Free; Manufacturer_Name: Molex Connector Corporation; Copyright: Copyright (C) 2025 Ultra Librarian. All rights reserved.; Manufacturer_Part_Number: 473460001; RefDes: RefDes; Type: Type

## Sheet TEMP.SchDoc
size A3; SheetNumber: 15; SheetTotal: 23
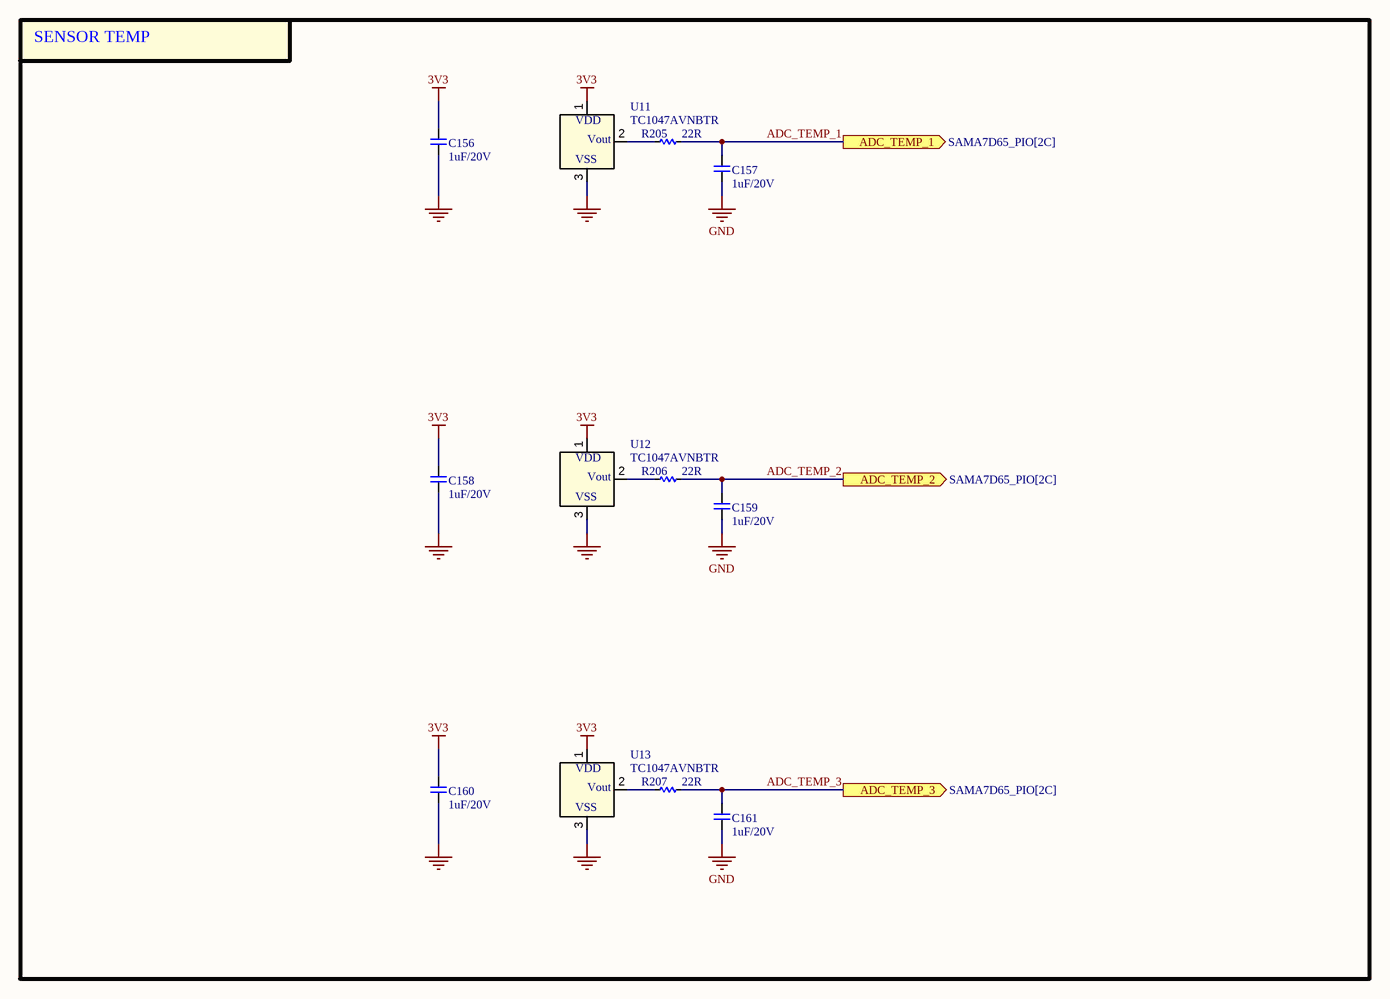
[diagram p19: TEMP.SchDoc]

### Parts
C156  1uF/20V  [CAP_C_1005X50_L]
C157  1uF/20V  [CAP_C_1005X50_L]
C158  1uF/20V  [CAP_C_1005X50_L]
C159  1uF/20V  [CAP_C_1005X50_L]
C160  1uF/20V  [CAP_C_1005X50_L]
C161  1uF/20V  [CAP_C_1005X50_L]
R205  22R  [RES_C_1005x30_L]
R206  22R  [RES_C_1005x30_L]
R207  22R  [RES_C_1005x30_L]
U11  TC1047AVNBTR  [SOT-23_MC_MCH]
U12  TC1047AVNBTR  [SOT-23_MC_MCH]
U13  TC1047AVNBTR  [SOT-23_MC_MCH]

### Blocks framed on the sheet
SENSOR TEMP: C156-C161 R205-R207 U11-U13

### Ports
ADC_TEMP_1 (out, see SAMA7D65_PIO[2C]), ADC_TEMP_2 (out, see SAMA7D65_PIO[2C]), ADC_TEMP_3 (out, see SAMA7D65_PIO[2C])

### Nets
3V3: C156.2 C158.2 C160.2 U11.1(VDD) U12.1(VDD) U13.1(VDD)
GND: C156.1 C157.1 C158.1 C159.1 C160.1 C161.1 U11.3(VSS) U12.3(VSS) U13.3(VSS)
ADC_TEMP_1: C157.2 R205.2 ; port ADC_TEMP_1
ADC_TEMP_2: C159.2 R206.2 ; port ADC_TEMP_2
ADC_TEMP_3: C161.2 R207.2 ; port ADC_TEMP_3
NetR205_1: R205.1 U11.2(VOUT)
NetR206_1: R206.1 U12.2(VOUT)
NetR207_1: R207.1 U13.2(VOUT)

### Notes on the sheet
- Project:
- Page Contents:
- Revision:
- Design:
- Date:
- Size:
- A3
- Document Number:
- Sheet:
- of
- (in symbol TC1047AVNBTR) Vout

### Library data of the parts
C156-C161 = _CAP_C_2: CAP CHIP
R205-R207 = _RES_B_2: RES
U11-U13 = TC1047AVNBTR: SENSOR ANALOG -40C-125C SOT23-3; Manufacturer_Name: Microchip; Copyright: Copyright (C) 2025 Ultra Librarian. All rights reserved.; Manufacturer_Part_Number: TC1047AVNBTR; RefDes: RefDes; Type: Type

## Sheet RTC.SchDoc
size A3; SheetNumber: 16; SheetTotal: 23
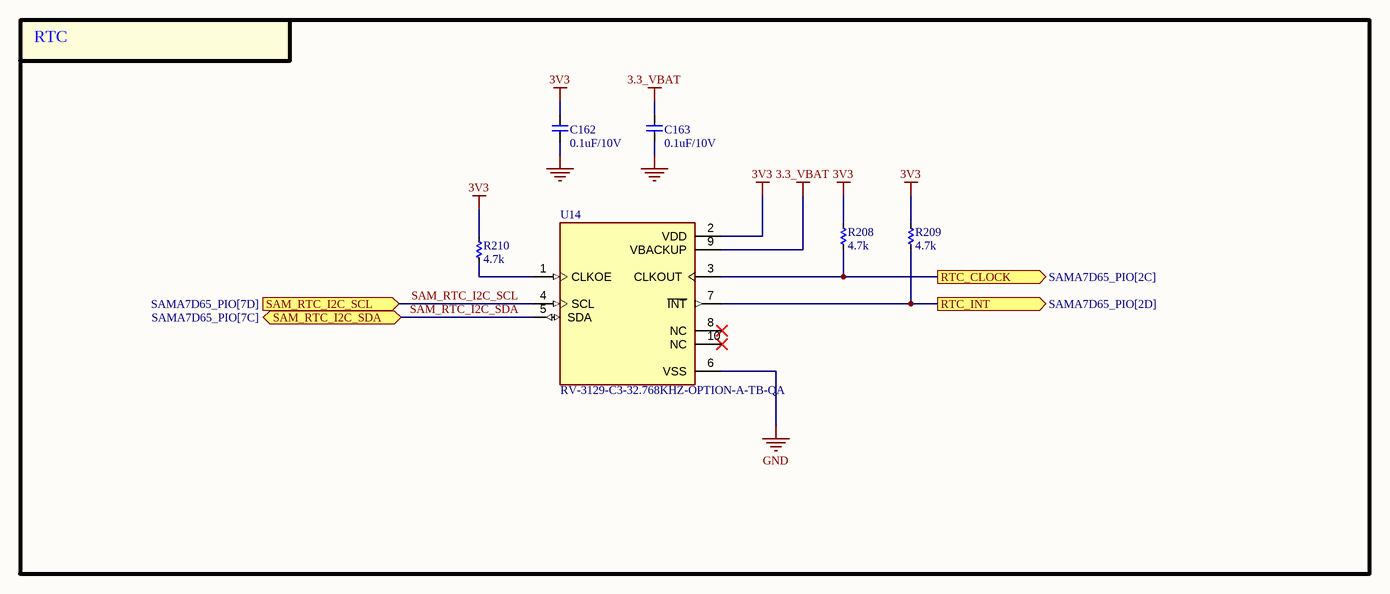
[diagram p20: RTC.SchDoc]

### Parts
C162  0.1uF/10V  [CAP_C_1005X50_L]
C163  0.1uF/10V  [CAP_C_1005X50_L]
R208  4.7k  [RES_C_1005x30_L]
R209  4.7k  [RES_C_1005x30_L]
R210  4.7k  [RES_C_1005x30_L]
U14  RV-3129-C3-32.768KHZ-OPTION-A-TB-QA  [IC_RV-3129-C3-32.768KHZ-OPTION-A-TB-QA]

### Blocks framed on the sheet
RTC: C162 C163 R208-R210 U14

### Ports
RTC_CLOCK (out, see SAMA7D65_PIO[2C]), RTC_INT (out, see SAMA7D65_PIO[2D]), SAM_RTC_I2C_SCL (in, see SAMA7D65_PIO[7D]), SAM_RTC_I2C_SDA (bidir, see SAMA7D65_PIO[7C])

### Nets
3.3_VBAT: C163.2 U14.9(VBACKUP)
3V3: C162.2 R208.1 R209.1 R210.1 U14.2(VDD)
GND: C162.1 C163.1 U14.6(VSS)
SAM_RTC_I2C_SCL: U14.4(SCL) ; port SAM_RTC_I2C_SCL
SAM_RTC_I2C_SDA: U14.5(SDA) ; port SAM_RTC_I2C_SDA
NetR140_2: R208.2 U14.3(CLKOUT) ; port RTC_CLOCK
NetR169_2: R209.2 U14.7(~{INT}) ; port RTC_INT
NetR210_2: R210.2 U14.1(CLKOE)

Not connected (* = marked no-connect by the designer): U14 8(NC)* 10(NC)*

### Notes on the sheet
- Project:
- Page Contents:
- Revision:
- Design:
- Date:
- Size:
- A3
- Document Number:
- Sheet:
- of

### Library data of the parts
C162 C163 = _CAP_C_2: CAP CHIP
R208-R210 = _RES_B_2: RES
U14 = RV-3129-C3-32.768KHZ-OPTION-A-TB-QA: Real-Time Clock Module with I2C-Bus; MP: RV-3129-C3-32.768KHZ-OPTION-A-TB-QA; Value: *; Price: None; Package: None; Availability: Unavailable

## Sheet WATCHDOG.SchDoc
size A3; SheetNumber: 17; SheetTotal: 23
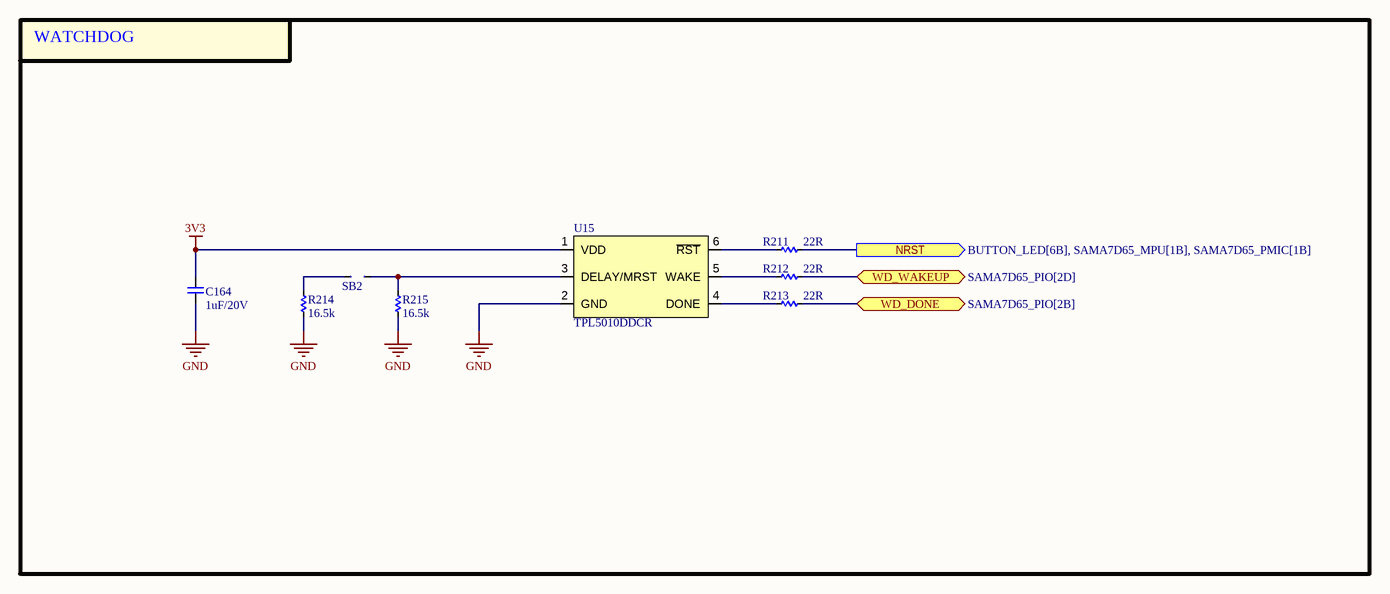
[diagram p21: WATCHDOG.SchDoc]

### Parts
C164  1uF/20V  [CAP_C_1005X50_L]
R211  22R  [RES_C_1005x30_L]
R212  22R  [RES_C_1005x30_L]
R213  22R  [RES_C_1005x30_L]
R214  16.5k  [RES_C_1005x30_L]
R215  16.5k  [RES_C_1005x30_L]
SB2  JUMPER  [JUMPER_1608]  (value not drawn)
U15  TPL5010DDCR  [TPL5010DDCR]

### Blocks framed on the sheet
WATCHDOG: C164 R211-R215 SB2 U15

### Ports
NRST (out, see BUTTON_LED[6B], SAMA7D65_MPU[1B], SAMA7D65_PMIC[1B]), WD_DONE (bidir, see SAMA7D65_PIO[2B]), WD_WAKEUP (bidir, see SAMA7D65_PIO[2D])

### Nets
3V3: C164.2 U15.1(VDD)
GND: C164.1 R214.2 R215.2 U15.2(GND)
NRST: R211.2 ; port NRST
NetR111_2: R213.2 ; port WD_DONE
NetR170_2: R212.2 ; port WD_WAKEUP
NetR211_1: R211.1 U15.6(~{RST})
NetR212_1: R212.1 U15.5(WAKE)
NetR213_1: R213.1 U15.4(DONE)
NetR214_1: R214.1 SB2.1
NetR215_1: R215.1 SB2.2 U15.3(DELAY/MRST)

### Notes on the sheet
- Project:
- Page Contents:
- Revision:
- Design:
- Date:
- Size:
- A3
- Document Number:
- Sheet:
- of

### Library data of the parts
C164 = _CAP_C_2: CAP CHIP
R211-R215 = _RES_B_2: RES
U15 = TPL5010DDCR: OSC PROG TIMER TSOT23-6

## Sheet LVDS.SchDoc
size A3; SheetNumber: 18; SheetTotal: 23
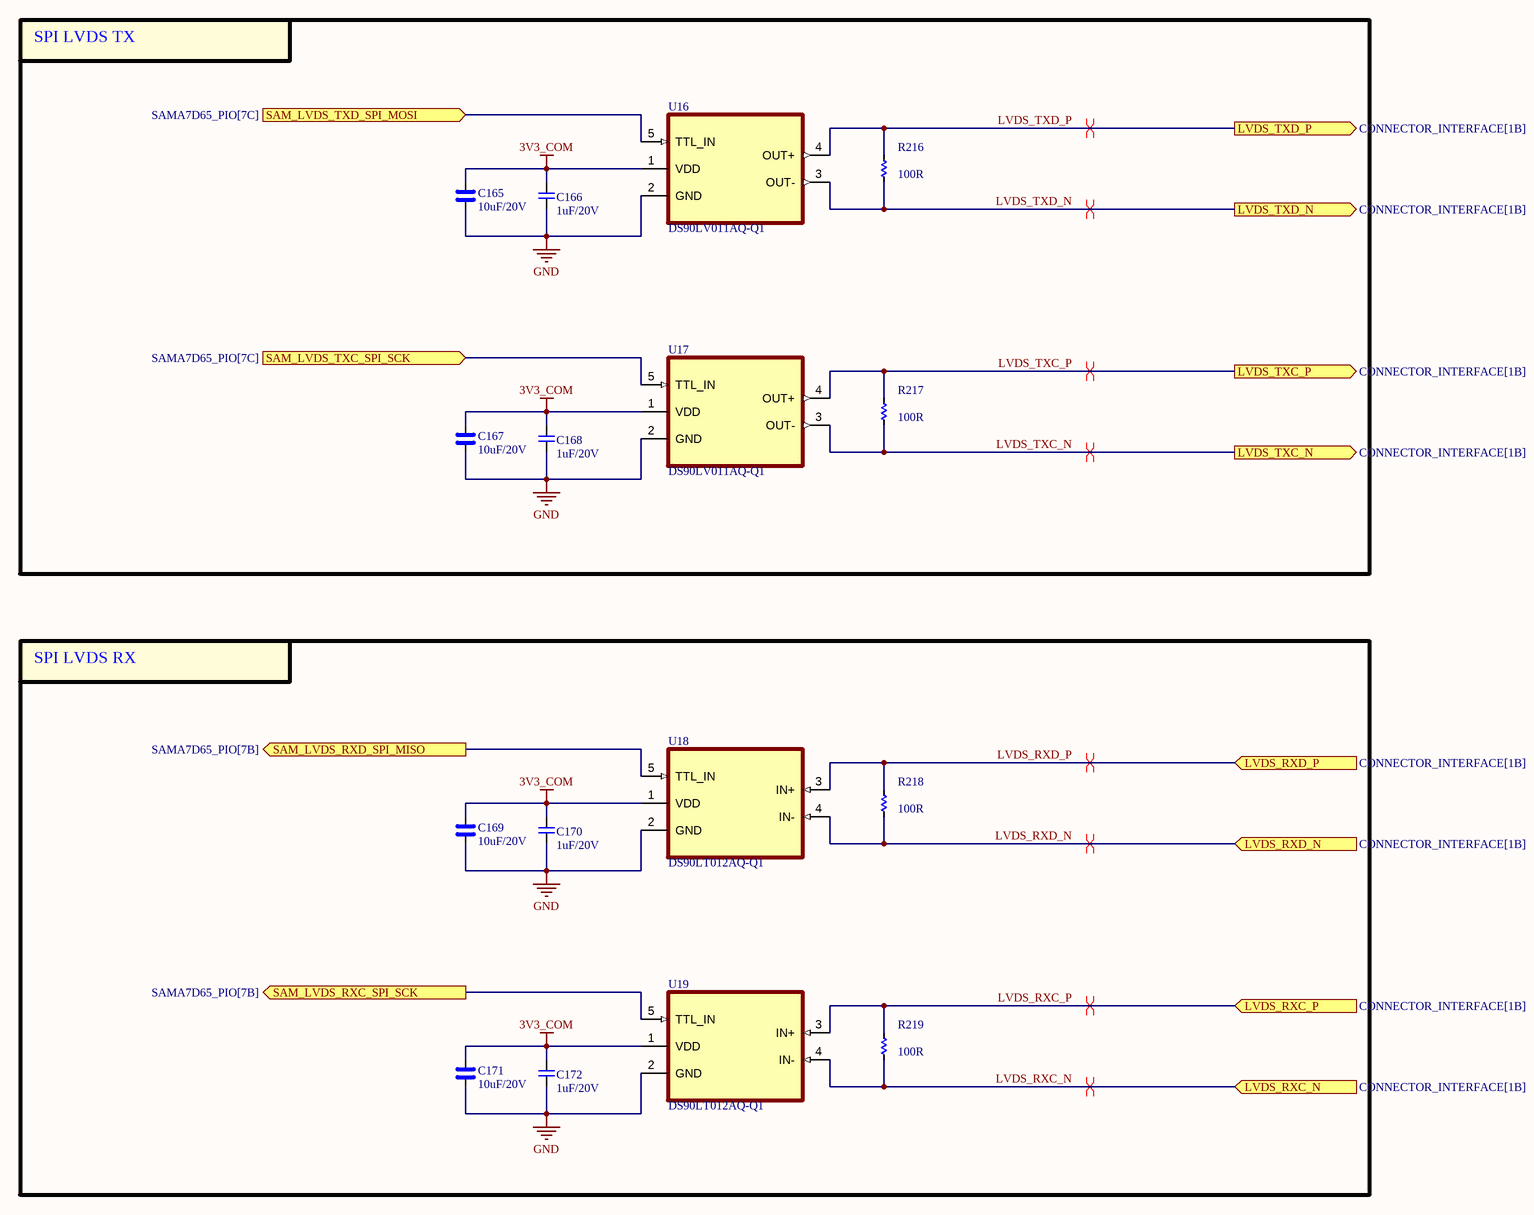
[diagram p22: LVDS.SchDoc]

### Parts
C165  10uF/20V  [CAP_C_2012X110]
C166  1uF/20V  [CAP_C_1005X50_L]
C167  10uF/20V  [CAP_C_2012X110]
C168  1uF/20V  [CAP_C_1005X50_L]
C169  10uF/20V  [CAP_C_2012X110]
C170  1uF/20V  [CAP_C_1005X50_L]
C171  10uF/20V  [CAP_C_2012X110]
C172  1uF/20V  [CAP_C_1005X50_L]
R216  100R  [RES_C_1005x30_L]
R217  100R  [RES_C_1005x30_L]
R218  100R  [RES_C_1005x30_L]
R219  100R  [RES_C_1005x30_L]
U16  DS90LV011AQ-Q1  [DS90LV011AQ-Q1]
U17  DS90LV011AQ-Q1  [DS90LV011AQ-Q1]
U18  DS90LT012AQ-Q1  [DS90LV011AQ-Q1]
U19  DS90LT012AQ-Q1  [DS90LV011AQ-Q1]

### Blocks framed on the sheet
SPI LVDS TX: C165-C168 R216 R217 U16 U17
SPI LVDS RX: C169-C172 R218 R219 U18 U19

### Ports
LVDS_RXC_N (in, see CONNECTOR_INTERFACE[1B]), LVDS_RXC_P (in, see CONNECTOR_INTERFACE[1B]), LVDS_RXD_N (in, see CONNECTOR_INTERFACE[1B]), LVDS_RXD_P (in, see CONNECTOR_INTERFACE[1B]), LVDS_TXC_N (out, see CONNECTOR_INTERFACE[1B]), LVDS_TXC_P (out, see CONNECTOR_INTERFACE[1B]), LVDS_TXD_N (out, see CONNECTOR_INTERFACE[1B]), LVDS_TXD_P (out, see CONNECTOR_INTERFACE[1B]), SAM_LVDS_RXC_SPI_SCK (out, see SAMA7D65_PIO[7B]), SAM_LVDS_RXD_SPI_MISO (out, see SAMA7D65_PIO[7B]), SAM_LVDS_TXC_SPI_SCK (in, see SAMA7D65_PIO[7C]), SAM_LVDS_TXD_SPI_MOSI (in, see SAMA7D65_PIO[7C])

### Nets
3V3_COM: C165.2 C166.2 C167.2 C168.2 C169.2 C170.2 C171.2 C172.2 U16.1(VDD) U17.1(VDD) U18.1(VDD) U19.1(VDD)
GND: C165.1 C166.1 C167.1 C168.1 C169.1 C170.1 C171.1 C172.1 U16.2(GND) U17.2(GND) U18.2(GND) U19.2(GND)
FLEXCOM2_SPI_CLK: U19.5(TTL_IN) ; port SAM_LVDS_RXC_SPI_SCK
FLEXCOM2_SPI_MISO: U18.5(TTL_IN) ; port SAM_LVDS_RXD_SPI_MISO
FLEXCOM8_SPI_CK: U17.5(TTL_IN) ; port SAM_LVDS_TXC_SPI_SCK
FLEXCOM8_SPI_MOSI: U16.5(TTL_IN) ; port SAM_LVDS_TXD_SPI_MOSI
LVDS_RXC_N: R219.2 U19.4(IN-) ; port LVDS_RXC_N
LVDS_RXC_P: R219.1 U19.3(IN+) ; port LVDS_RXC_P
LVDS_RXD_N: R218.2 U18.4(IN-) ; port LVDS_RXD_N
LVDS_RXD_P: R218.1 U18.3(IN+) ; port LVDS_RXD_P
LVDS_TXC_N: R217.2 U17.3(OUT-) ; port LVDS_TXC_N
LVDS_TXC_P: R217.1 U17.4(OUT+) ; port LVDS_TXC_P
LVDS_TXD_N: R216.2 U16.3(OUT-) ; port LVDS_TXD_N
LVDS_TXD_P: R216.1 U16.4(OUT+) ; port LVDS_TXD_P

### Layout directives
differential pair: LVDS_RXC_N, LVDS_RXC_P, LVDS_RXD_N, LVDS_RXD_P, LVDS_TXC_N, LVDS_TXC_P, LVDS_TXD_N, LVDS_TXD_P

### Notes on the sheet
- Project:
- Page Contents:
- Revision:
- Design:
- Date:
- Size:
- A3
- Document Number:
- Sheet:
- of

### Library data of the parts
C165 C167 C169 C171 = _CAP_C_High_2: CAP CHIP High Value
C166 C168 C170 C172 = _CAP_C_2: CAP CHIP
R216-R219 = _RES_B_2: RES
U16 U17 = DS90LV011AQ-Q1: Automotive LVDS Differential Driver
U18 U19 = DS90LT012AQ-Q1: Automotive LVDS Differential Line Receiver